# EAGLE schematic UCirKitBreadboardWithEverythingBottom-08201626 (EAGLE 6.5.0), part 1 of 2
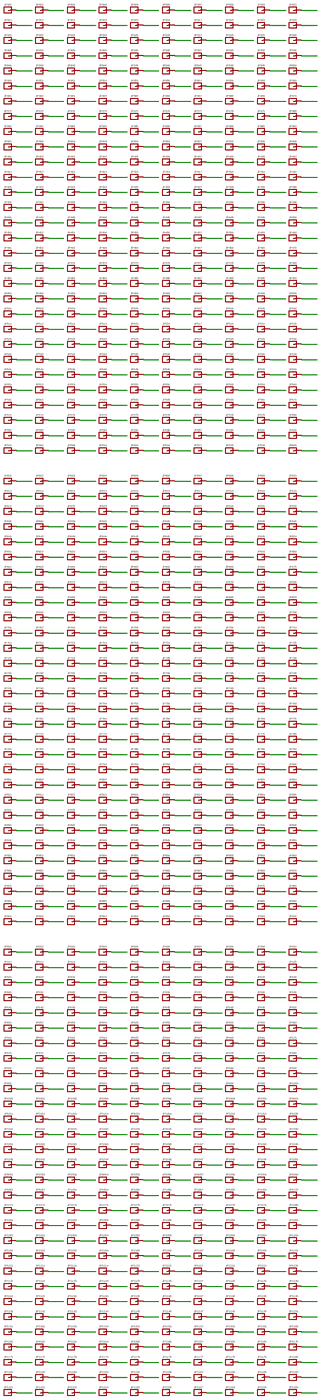
[diagram p0: schematic, sheet 1, overview]
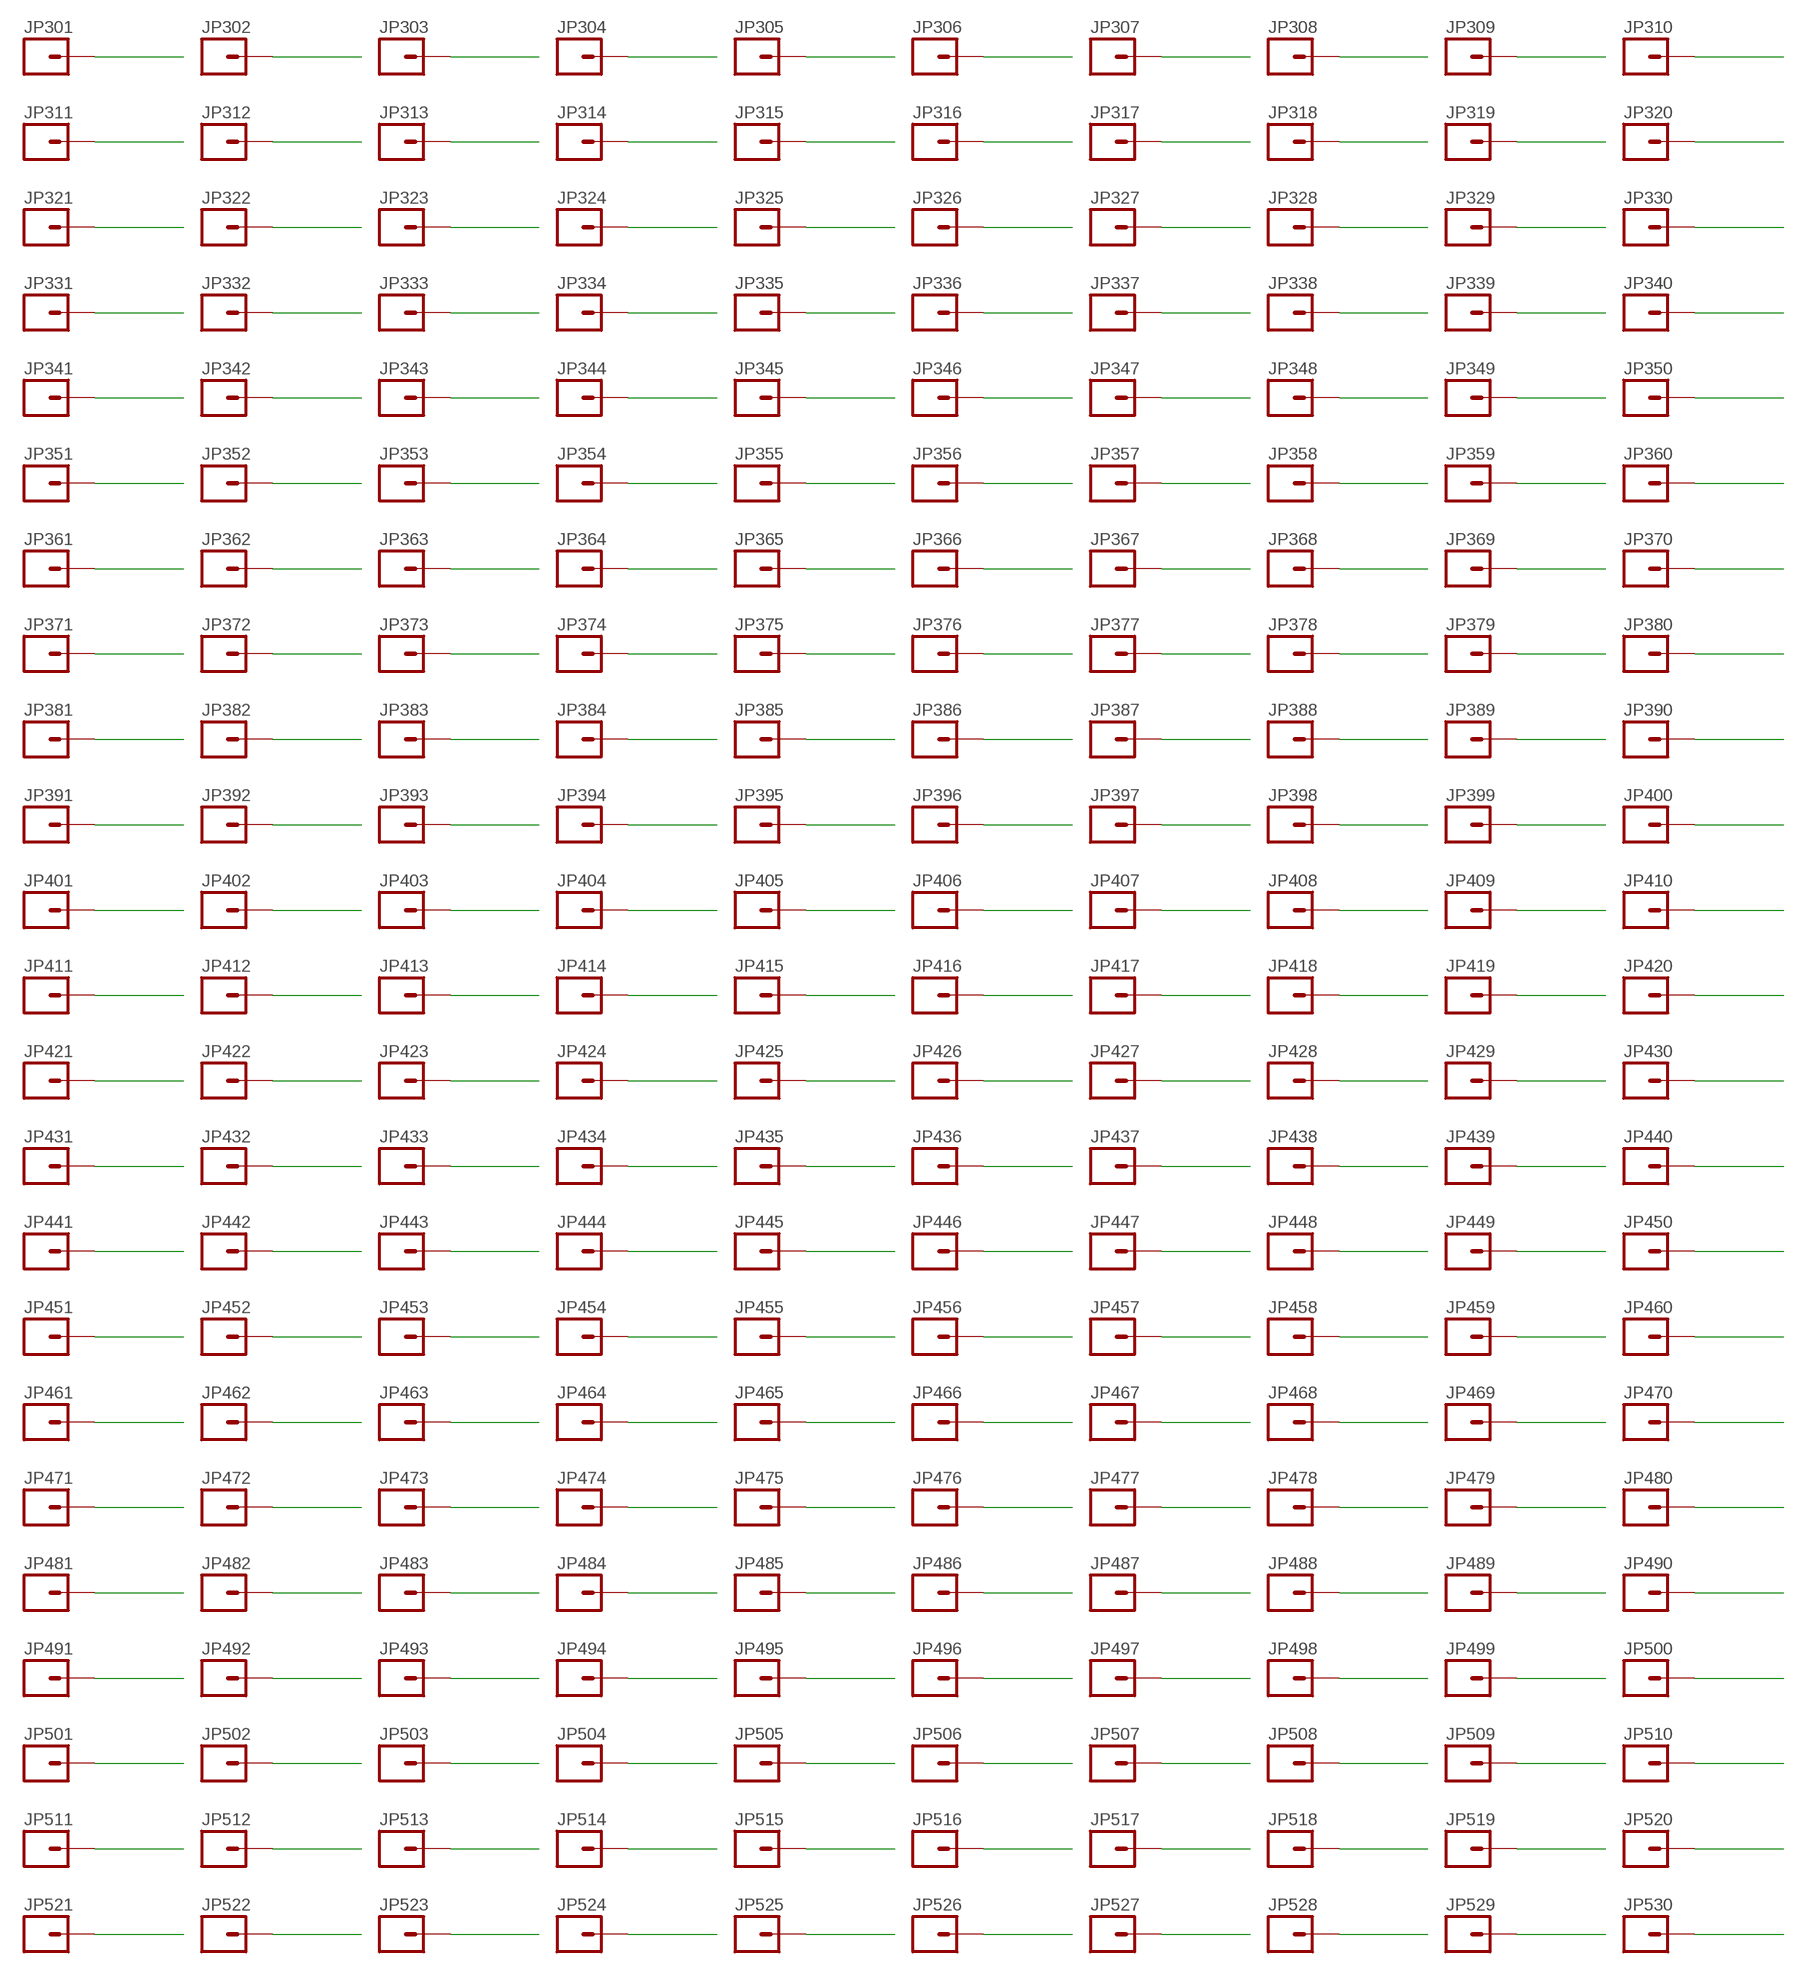
[diagram p1: schematic, sheet 1, part 1 of 4]
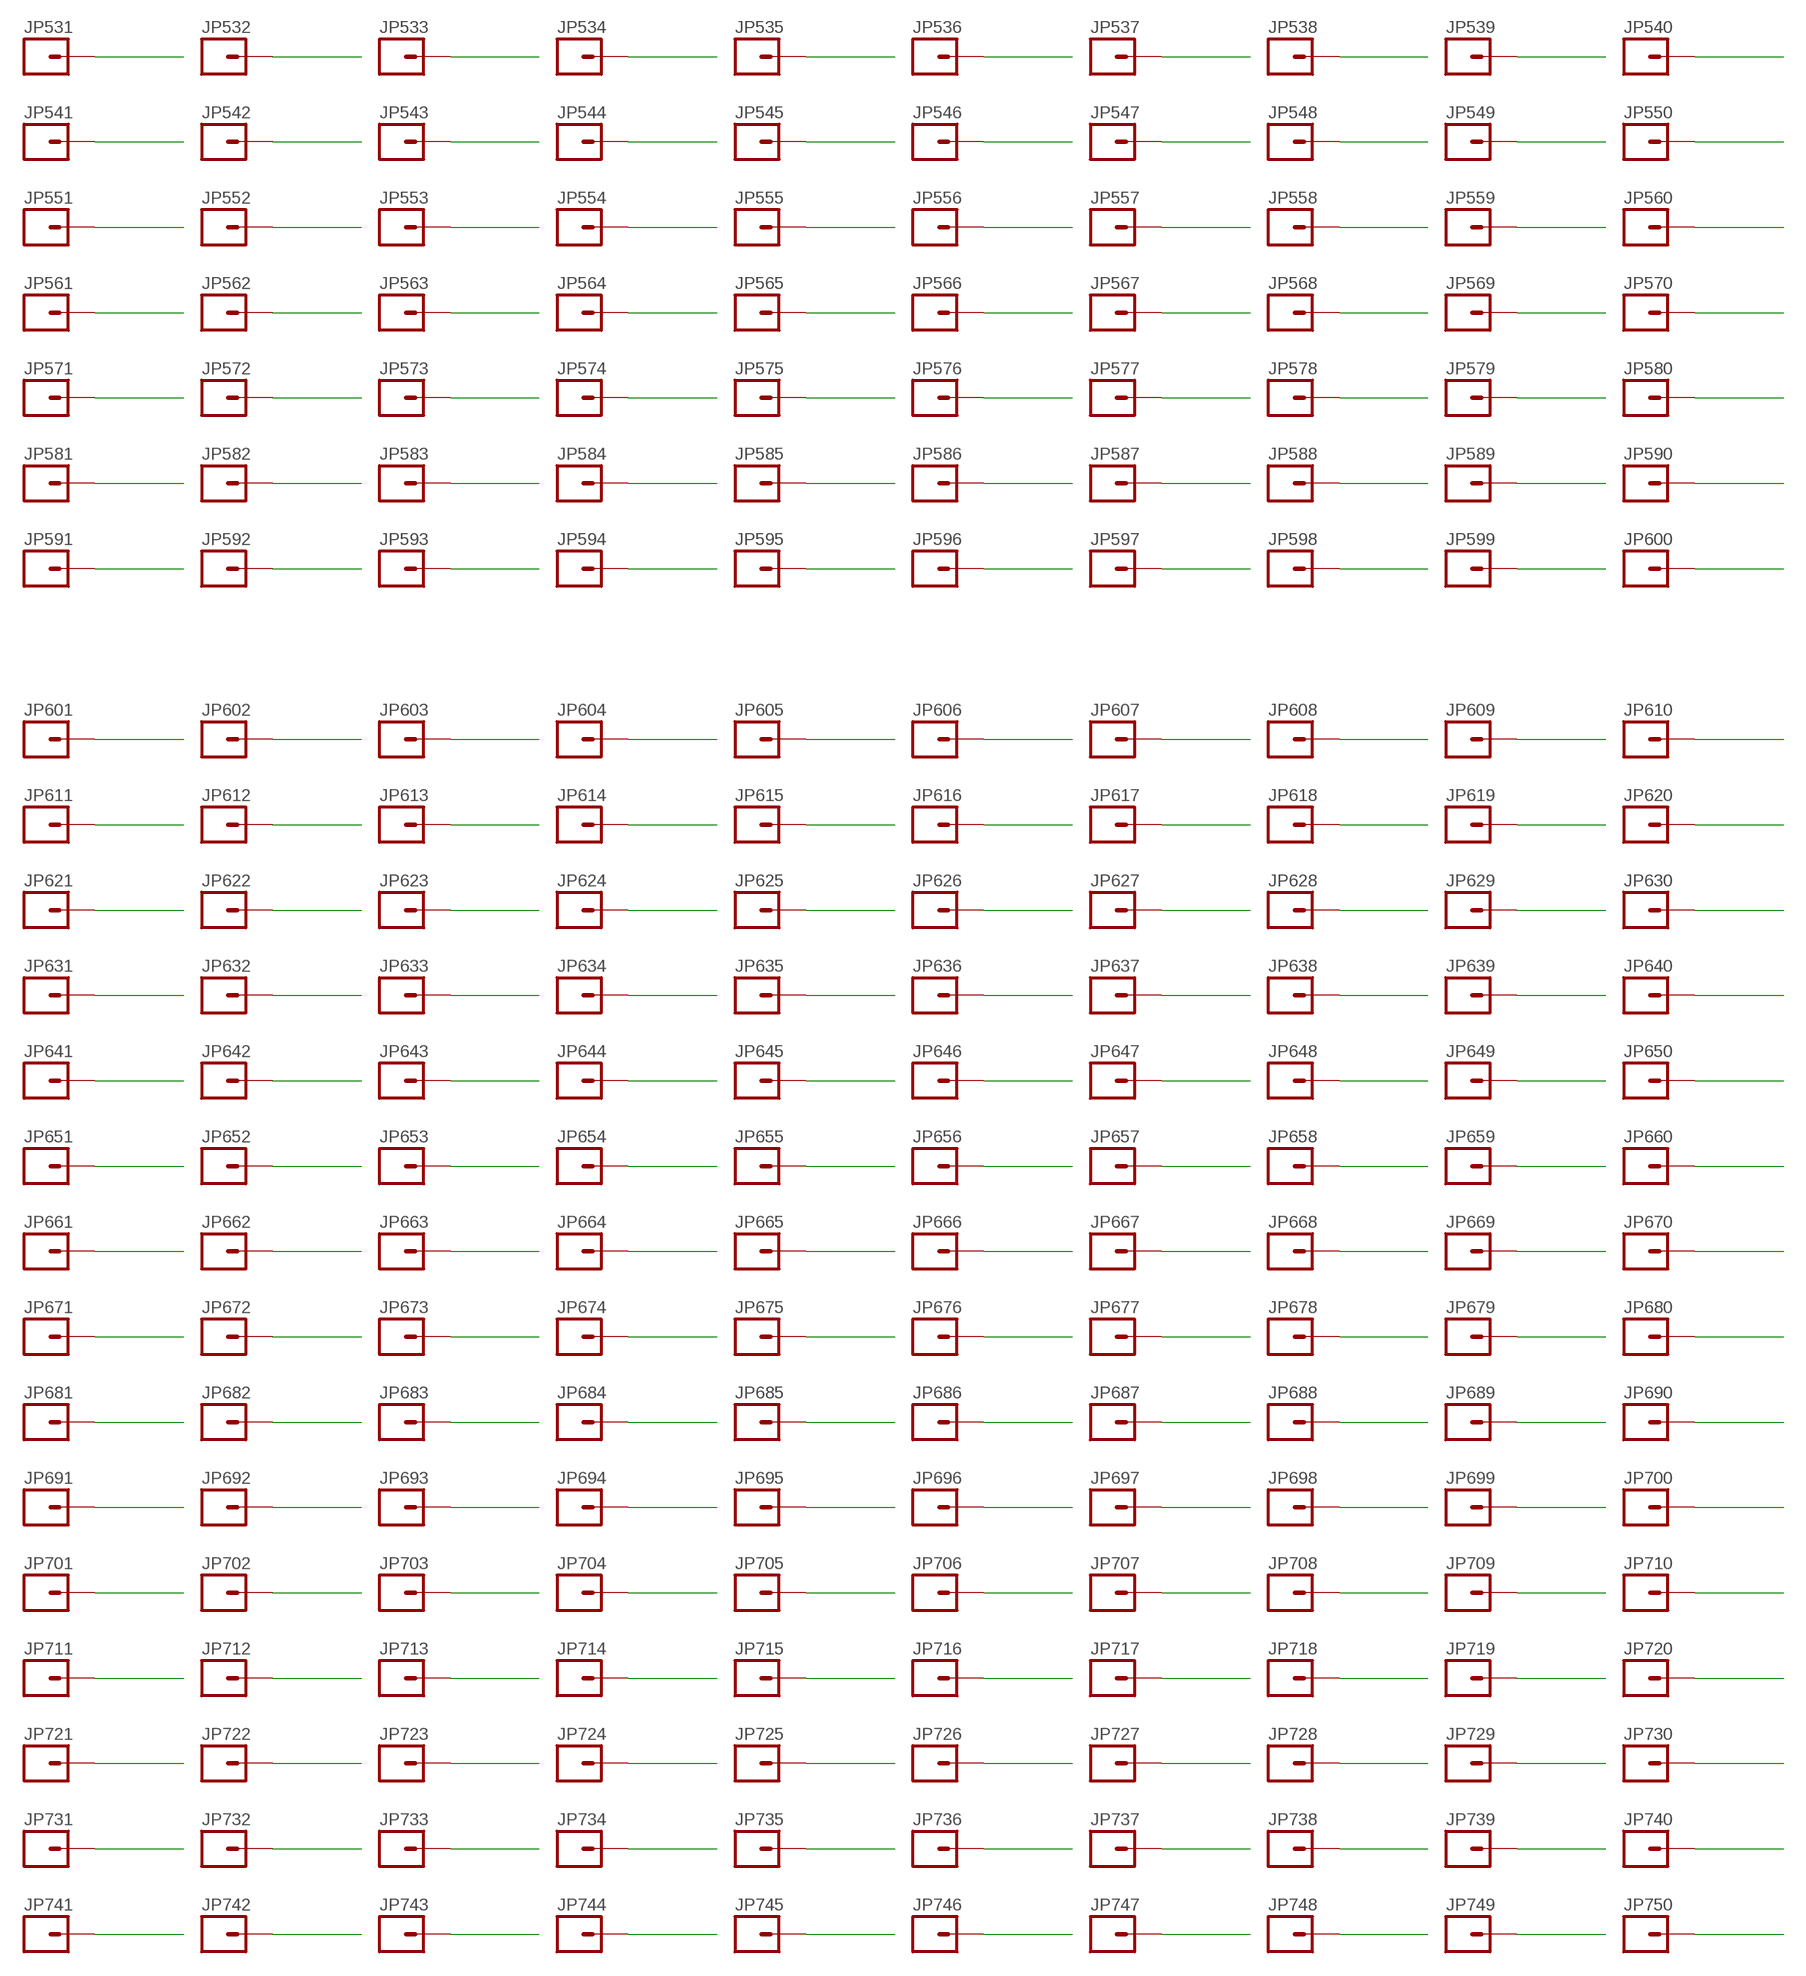
[diagram p2: schematic, sheet 1, part 2 of 4]
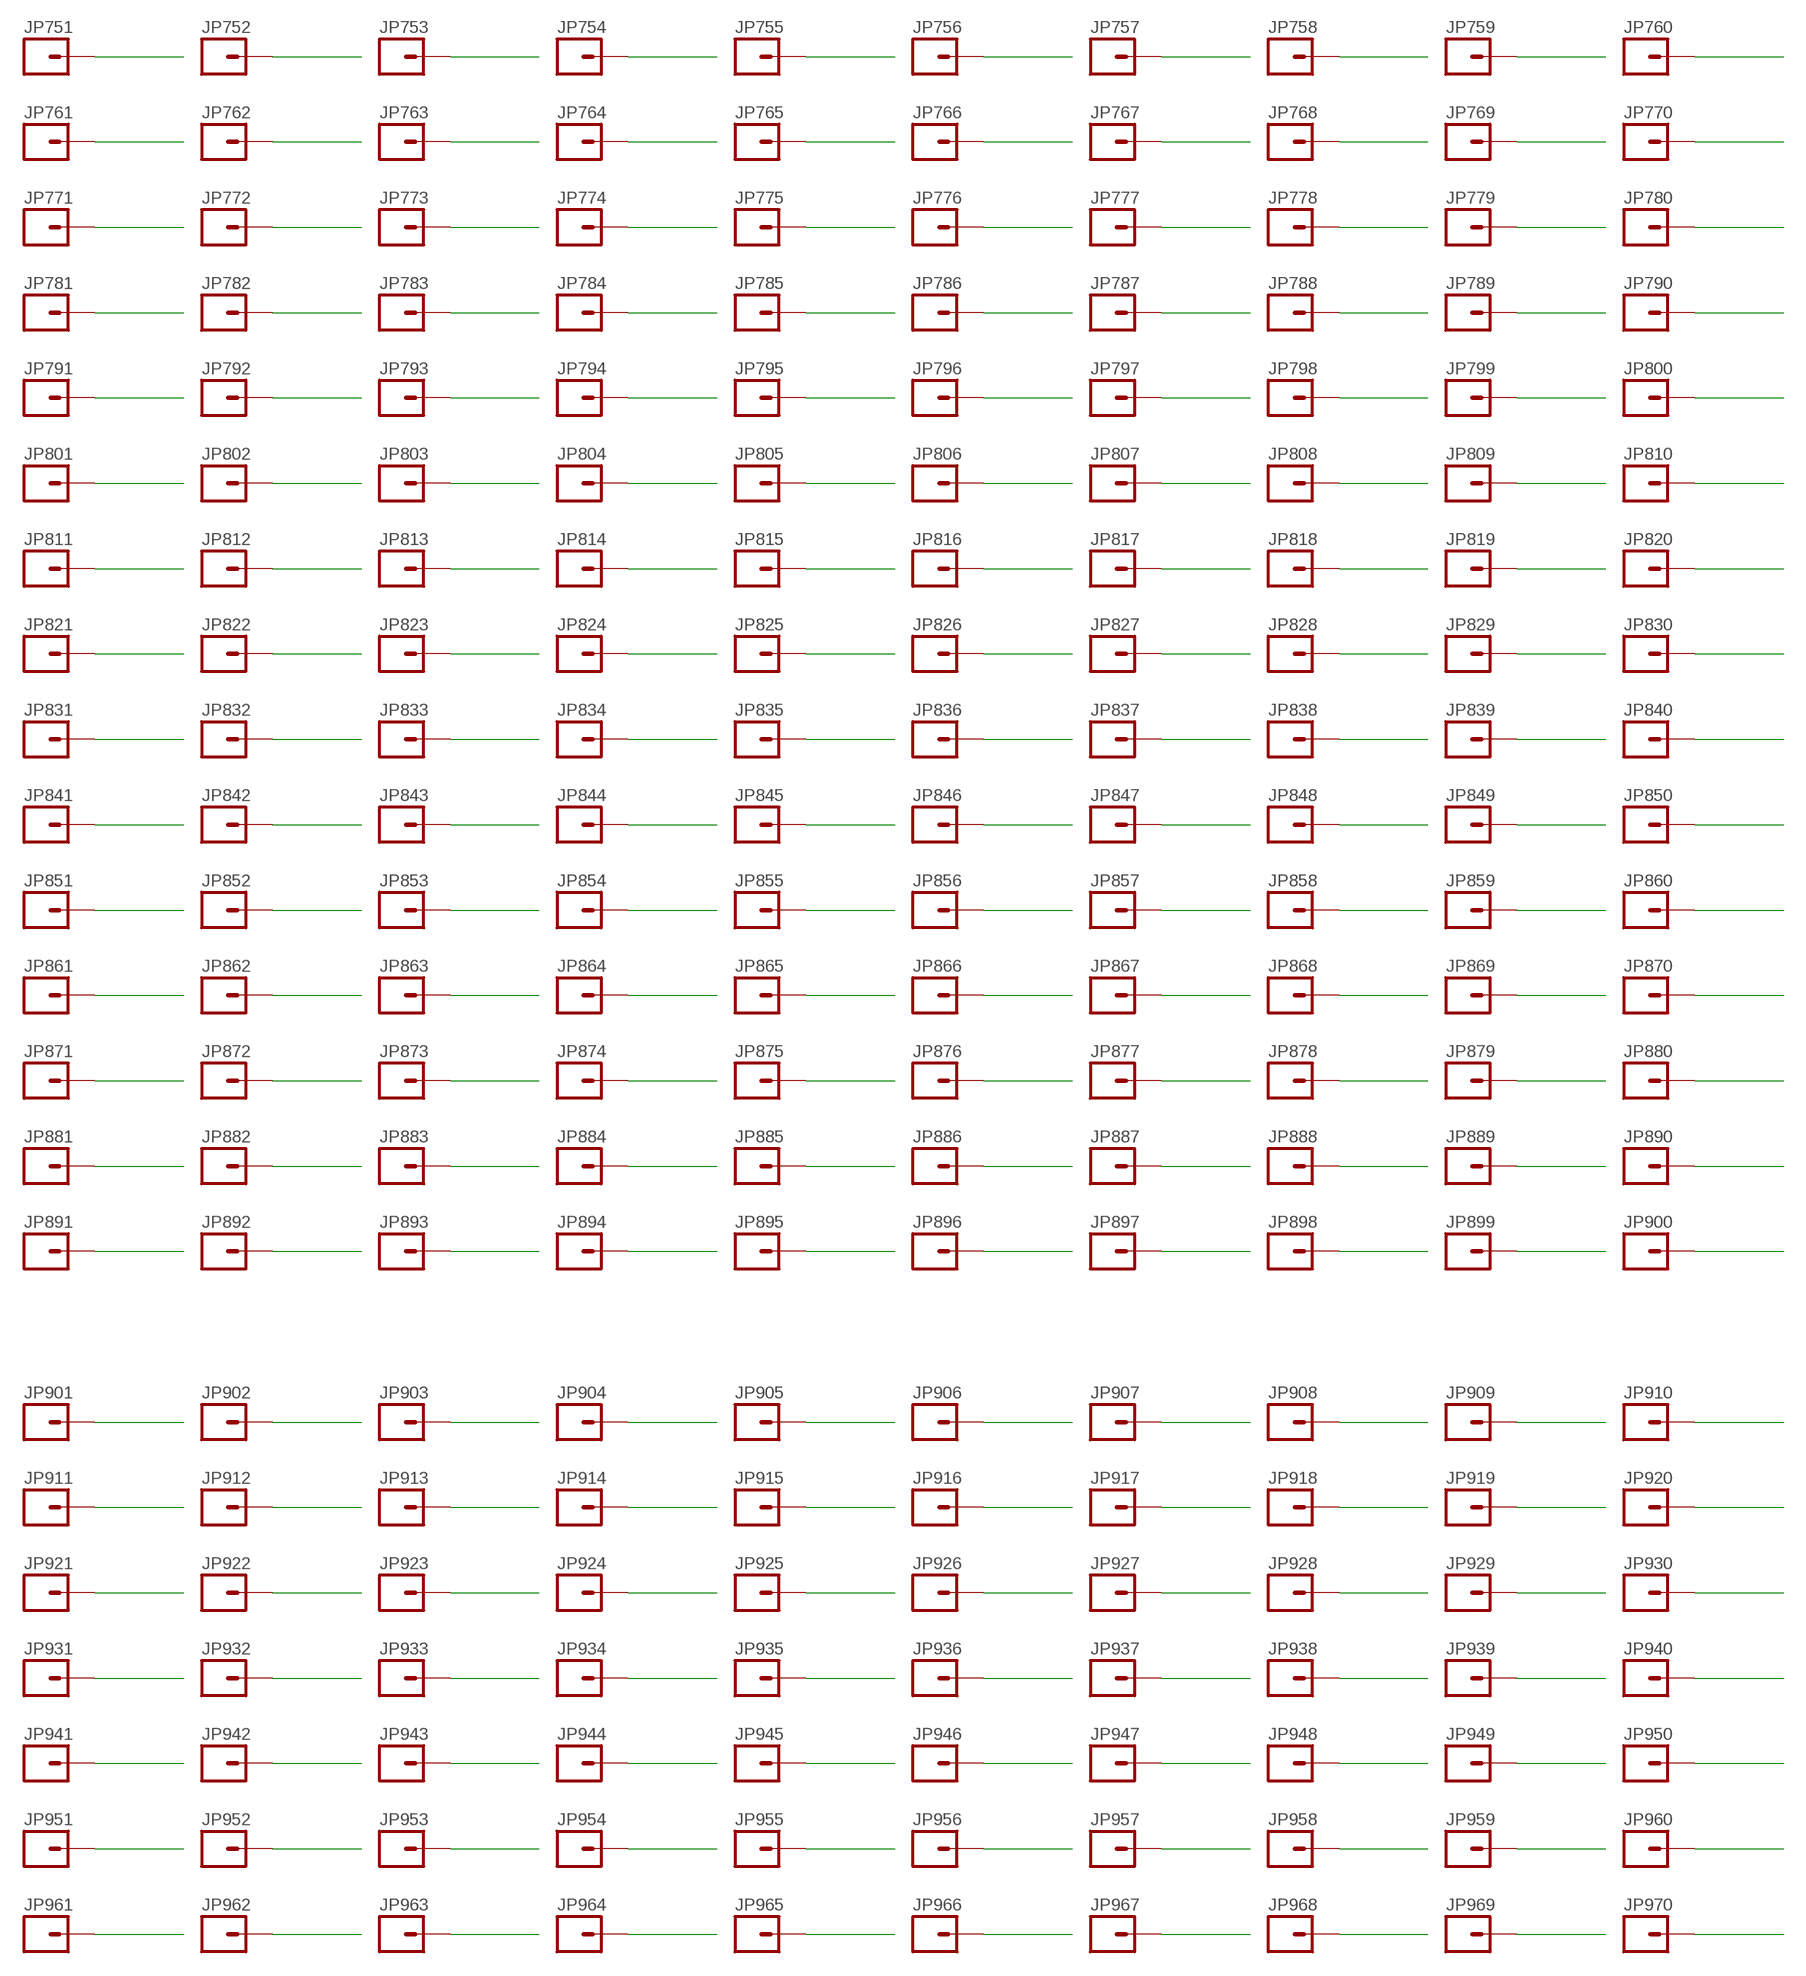
[diagram p3: schematic, sheet 1, part 3 of 4]
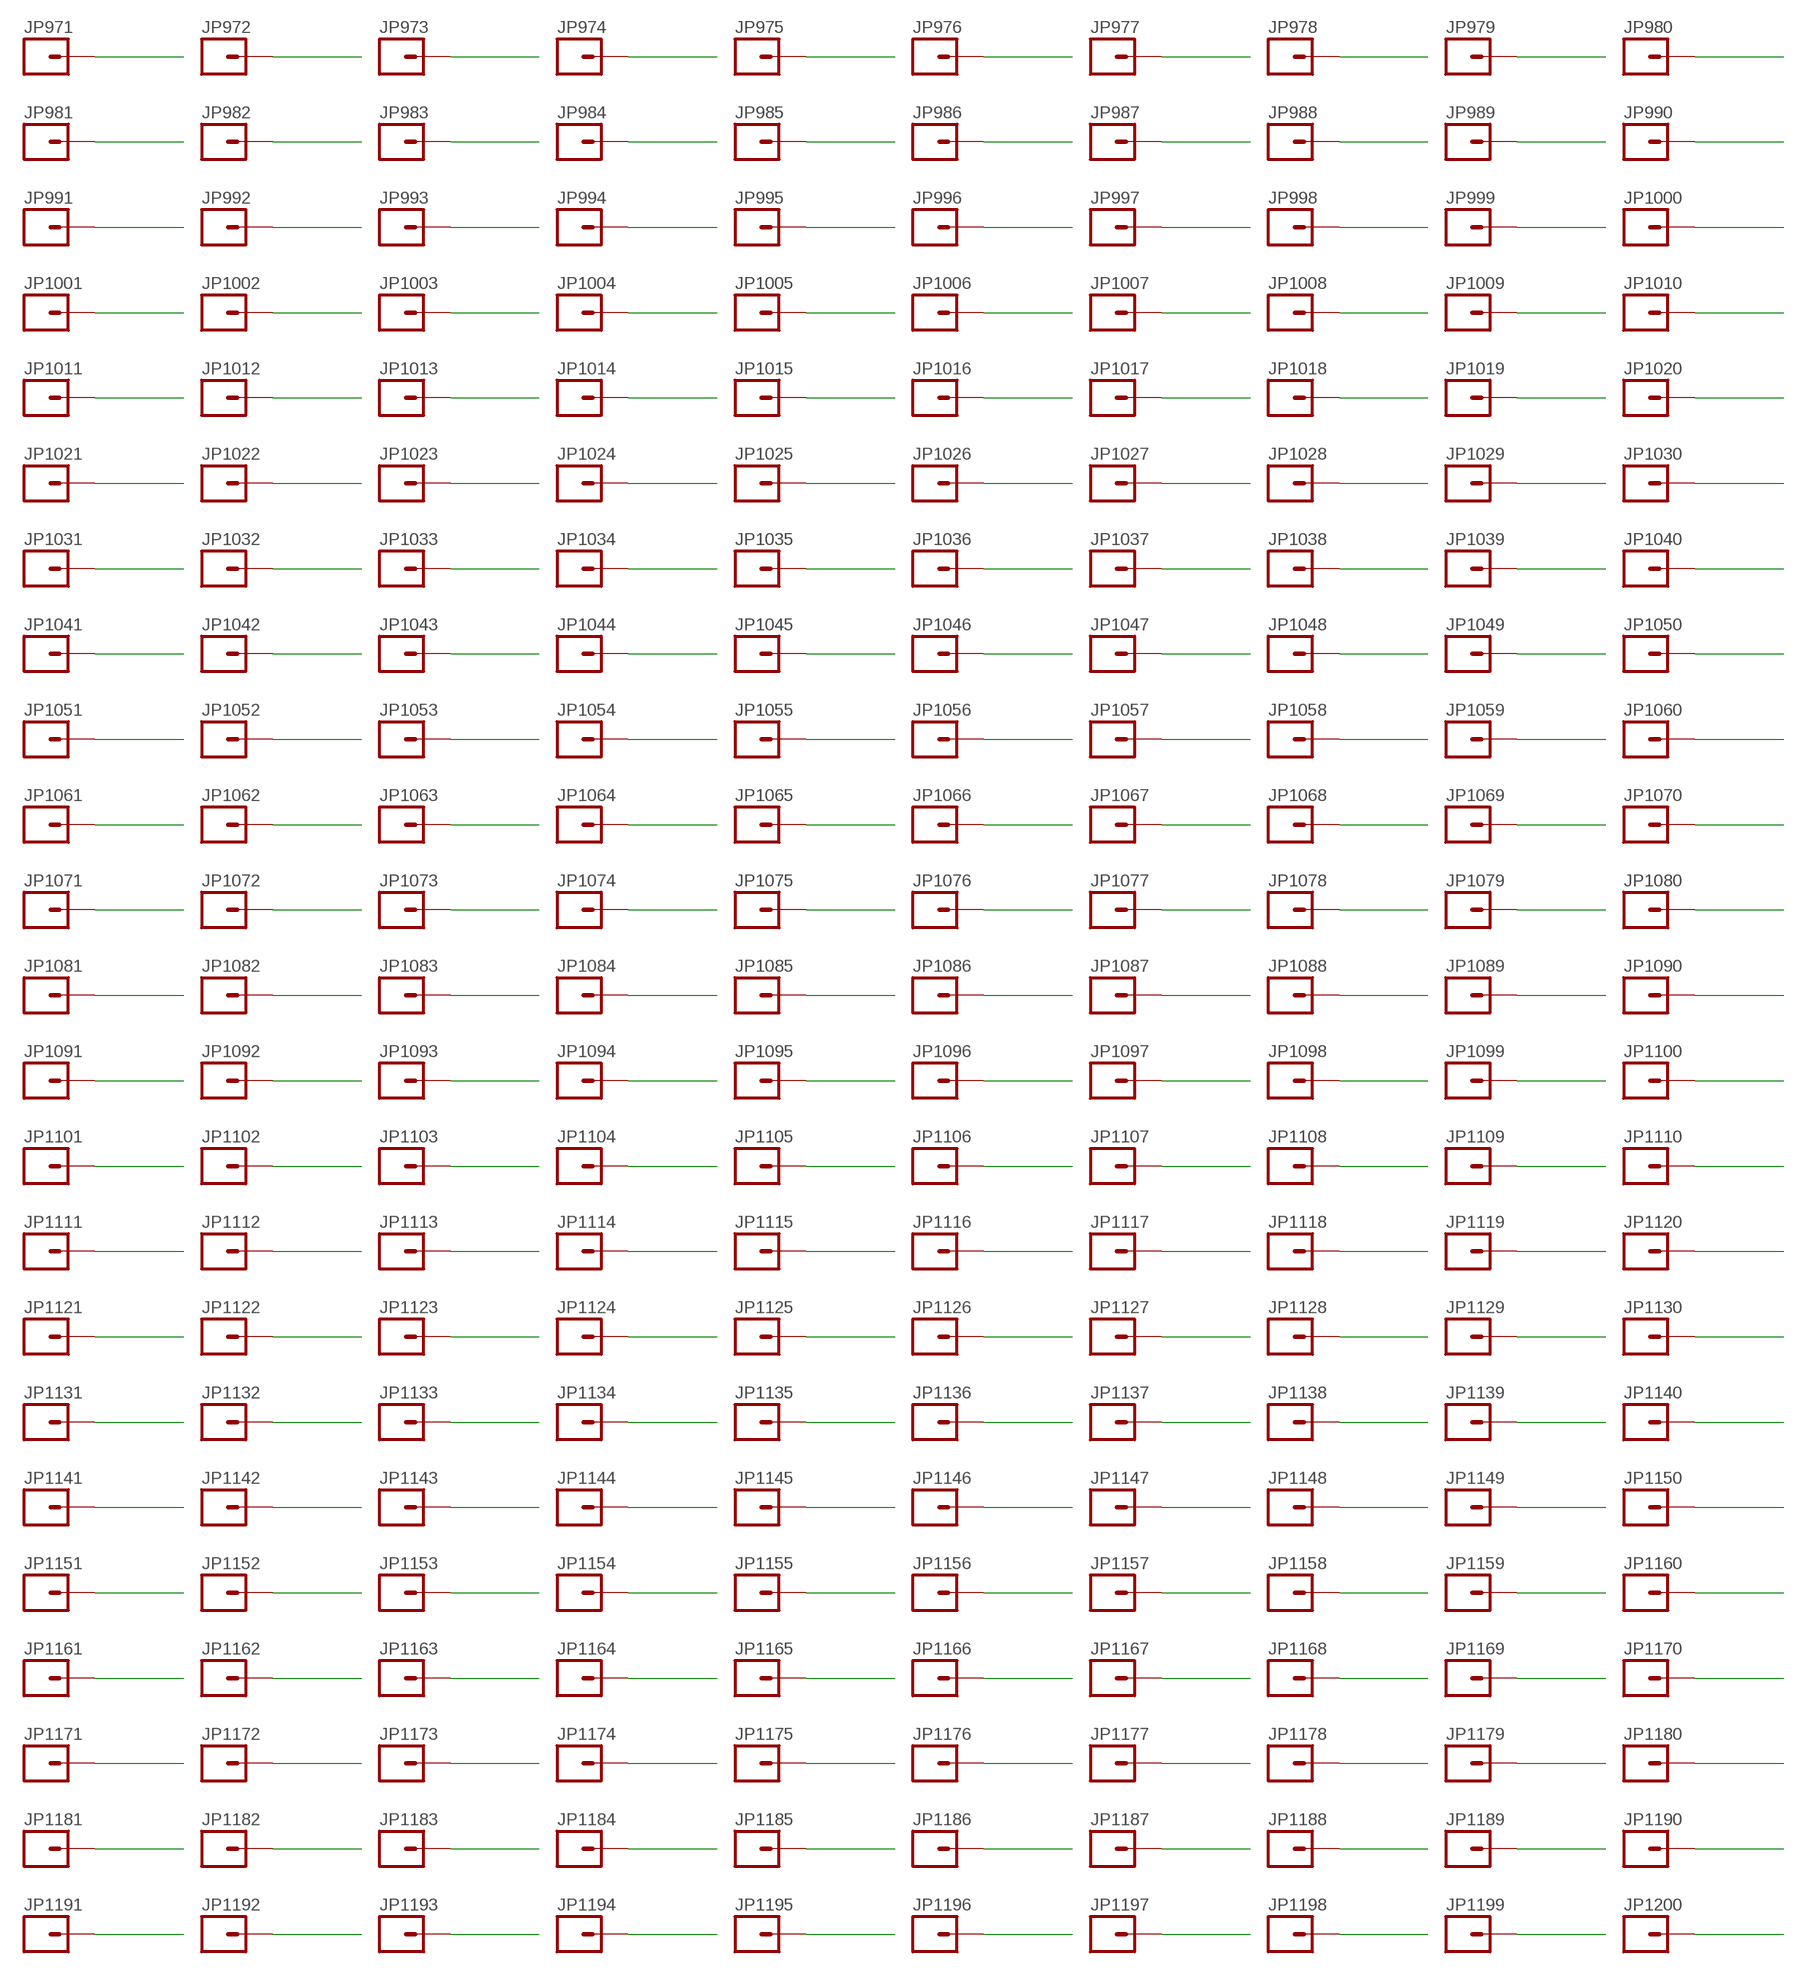
[diagram p4: schematic, sheet 1, part 4 of 4]

## Parts
JP301  M01PTH_SMD_3.25X0.85MM_NO_SILK  [1X01_SMD_3.25X0.85MM_NO_SILK]
JP302  M01PTH_SMD_3.25X0.85MM_NO_SILK  [1X01_SMD_3.25X0.85MM_NO_SILK]
JP303  M01PTH_SMD_3.25X0.85MM_NO_SILK  [1X01_SMD_3.25X0.85MM_NO_SILK]
JP304  M01PTH_SMD_3.25X0.85MM_NO_SILK  [1X01_SMD_3.25X0.85MM_NO_SILK]
JP305  M01PTH_SMD_3.25X0.85MM_NO_SILK  [1X01_SMD_3.25X0.85MM_NO_SILK]
JP306  M01PTH_SMD_3.25X0.85MM_NO_SILK  [1X01_SMD_3.25X0.85MM_NO_SILK]
JP307  M01PTH_SMD_3.25X0.85MM_NO_SILK  [1X01_SMD_3.25X0.85MM_NO_SILK]
JP308  M01PTH_SMD_3.25X0.85MM_NO_SILK  [1X01_SMD_3.25X0.85MM_NO_SILK]
JP309  M01PTH_SMD_3.25X0.85MM_NO_SILK  [1X01_SMD_3.25X0.85MM_NO_SILK]
JP310  M01PTH_SMD_3.25X0.85MM_NO_SILK  [1X01_SMD_3.25X0.85MM_NO_SILK]
JP311  M01PTH_SMD_3.25X0.85MM_NO_SILK  [1X01_SMD_3.25X0.85MM_NO_SILK]
JP312  M01PTH_SMD_3.25X0.85MM_NO_SILK  [1X01_SMD_3.25X0.85MM_NO_SILK]
JP313  M01PTH_SMD_3.25X0.85MM_NO_SILK  [1X01_SMD_3.25X0.85MM_NO_SILK]
JP314  M01PTH_SMD_3.25X0.85MM_NO_SILK  [1X01_SMD_3.25X0.85MM_NO_SILK]
JP315  M01PTH_SMD_3.25X0.85MM_NO_SILK  [1X01_SMD_3.25X0.85MM_NO_SILK]
JP316  M01PTH_SMD_3.25X0.85MM_NO_SILK  [1X01_SMD_3.25X0.85MM_NO_SILK]
JP317  M01PTH_SMD_3.25X0.85MM_NO_SILK  [1X01_SMD_3.25X0.85MM_NO_SILK]
JP318  M01PTH_SMD_3.25X0.85MM_NO_SILK  [1X01_SMD_3.25X0.85MM_NO_SILK]
JP319  M01PTH_SMD_3.25X0.85MM_NO_SILK  [1X01_SMD_3.25X0.85MM_NO_SILK]
JP320  M01PTH_SMD_3.25X0.85MM_NO_SILK  [1X01_SMD_3.25X0.85MM_NO_SILK]
JP321  M01PTH_SMD_3.25X0.85MM_NO_SILK  [1X01_SMD_3.25X0.85MM_NO_SILK]
JP322  M01PTH_SMD_3.25X0.85MM_NO_SILK  [1X01_SMD_3.25X0.85MM_NO_SILK]
JP323  M01PTH_SMD_3.25X0.85MM_NO_SILK  [1X01_SMD_3.25X0.85MM_NO_SILK]
JP324  M01PTH_SMD_3.25X0.85MM_NO_SILK  [1X01_SMD_3.25X0.85MM_NO_SILK]
JP325  M01PTH_SMD_3.25X0.85MM_NO_SILK  [1X01_SMD_3.25X0.85MM_NO_SILK]
JP326  M01PTH_SMD_3.25X0.85MM_NO_SILK  [1X01_SMD_3.25X0.85MM_NO_SILK]
JP327  M01PTH_SMD_3.25X0.85MM_NO_SILK  [1X01_SMD_3.25X0.85MM_NO_SILK]
JP328  M01PTH_SMD_3.25X0.85MM_NO_SILK  [1X01_SMD_3.25X0.85MM_NO_SILK]
JP329  M01PTH_SMD_3.25X0.85MM_NO_SILK  [1X01_SMD_3.25X0.85MM_NO_SILK]
JP330  M01PTH_SMD_3.25X0.85MM_NO_SILK  [1X01_SMD_3.25X0.85MM_NO_SILK]
JP331  M01PTH_SMD_3.25X0.85MM_NO_SILK  [1X01_SMD_3.25X0.85MM_NO_SILK]
JP332  M01PTH_SMD_3.25X0.85MM_NO_SILK  [1X01_SMD_3.25X0.85MM_NO_SILK]
JP333  M01PTH_SMD_3.25X0.85MM_NO_SILK  [1X01_SMD_3.25X0.85MM_NO_SILK]
JP334  M01PTH_SMD_3.25X0.85MM_NO_SILK  [1X01_SMD_3.25X0.85MM_NO_SILK]
JP335  M01PTH_SMD_3.25X0.85MM_NO_SILK  [1X01_SMD_3.25X0.85MM_NO_SILK]
JP336  M01PTH_SMD_3.25X0.85MM_NO_SILK  [1X01_SMD_3.25X0.85MM_NO_SILK]
JP337  M01PTH_SMD_3.25X0.85MM_NO_SILK  [1X01_SMD_3.25X0.85MM_NO_SILK]
JP338  M01PTH_SMD_3.25X0.85MM_NO_SILK  [1X01_SMD_3.25X0.85MM_NO_SILK]
JP339  M01PTH_SMD_3.25X0.85MM_NO_SILK  [1X01_SMD_3.25X0.85MM_NO_SILK]
JP340  M01PTH_SMD_3.25X0.85MM_NO_SILK  [1X01_SMD_3.25X0.85MM_NO_SILK]
JP341  M01PTH_SMD_3.25X0.85MM_NO_SILK  [1X01_SMD_3.25X0.85MM_NO_SILK]
JP342  M01PTH_SMD_3.25X0.85MM_NO_SILK  [1X01_SMD_3.25X0.85MM_NO_SILK]
JP343  M01PTH_SMD_3.25X0.85MM_NO_SILK  [1X01_SMD_3.25X0.85MM_NO_SILK]
JP344  M01PTH_SMD_3.25X0.85MM_NO_SILK  [1X01_SMD_3.25X0.85MM_NO_SILK]
JP345  M01PTH_SMD_3.25X0.85MM_NO_SILK  [1X01_SMD_3.25X0.85MM_NO_SILK]
JP346  M01PTH_SMD_3.25X0.85MM_NO_SILK  [1X01_SMD_3.25X0.85MM_NO_SILK]
JP347  M01PTH_SMD_3.25X0.85MM_NO_SILK  [1X01_SMD_3.25X0.85MM_NO_SILK]
JP348  M01PTH_SMD_3.25X0.85MM_NO_SILK  [1X01_SMD_3.25X0.85MM_NO_SILK]
JP349  M01PTH_SMD_3.25X0.85MM_NO_SILK  [1X01_SMD_3.25X0.85MM_NO_SILK]
JP350  M01PTH_SMD_3.25X0.85MM_NO_SILK  [1X01_SMD_3.25X0.85MM_NO_SILK]
JP351  M01PTH_SMD_3.25X0.85MM_NO_SILK  [1X01_SMD_3.25X0.85MM_NO_SILK]
JP352  M01PTH_SMD_3.25X0.85MM_NO_SILK  [1X01_SMD_3.25X0.85MM_NO_SILK]
JP353  M01PTH_SMD_3.25X0.85MM_NO_SILK  [1X01_SMD_3.25X0.85MM_NO_SILK]
JP354  M01PTH_SMD_3.25X0.85MM_NO_SILK  [1X01_SMD_3.25X0.85MM_NO_SILK]
JP355  M01PTH_SMD_3.25X0.85MM_NO_SILK  [1X01_SMD_3.25X0.85MM_NO_SILK]
JP356  M01PTH_SMD_3.25X0.85MM_NO_SILK  [1X01_SMD_3.25X0.85MM_NO_SILK]
JP357  M01PTH_SMD_3.25X0.85MM_NO_SILK  [1X01_SMD_3.25X0.85MM_NO_SILK]
JP358  M01PTH_SMD_3.25X0.85MM_NO_SILK  [1X01_SMD_3.25X0.85MM_NO_SILK]
JP359  M01PTH_SMD_3.25X0.85MM_NO_SILK  [1X01_SMD_3.25X0.85MM_NO_SILK]
JP360  M01PTH_SMD_3.25X0.85MM_NO_SILK  [1X01_SMD_3.25X0.85MM_NO_SILK]
JP361  M01PTH_SMD_3.25X0.85MM_NO_SILK  [1X01_SMD_3.25X0.85MM_NO_SILK]
JP362  M01PTH_SMD_3.25X0.85MM_NO_SILK  [1X01_SMD_3.25X0.85MM_NO_SILK]
JP363  M01PTH_SMD_3.25X0.85MM_NO_SILK  [1X01_SMD_3.25X0.85MM_NO_SILK]
JP364  M01PTH_SMD_3.25X0.85MM_NO_SILK  [1X01_SMD_3.25X0.85MM_NO_SILK]
JP365  M01PTH_SMD_3.25X0.85MM_NO_SILK  [1X01_SMD_3.25X0.85MM_NO_SILK]
JP366  M01PTH_SMD_3.25X0.85MM_NO_SILK  [1X01_SMD_3.25X0.85MM_NO_SILK]
JP367  M01PTH_SMD_3.25X0.85MM_NO_SILK  [1X01_SMD_3.25X0.85MM_NO_SILK]
JP368  M01PTH_SMD_3.25X0.85MM_NO_SILK  [1X01_SMD_3.25X0.85MM_NO_SILK]
JP369  M01PTH_SMD_3.25X0.85MM_NO_SILK  [1X01_SMD_3.25X0.85MM_NO_SILK]
JP370  M01PTH_SMD_3.25X0.85MM_NO_SILK  [1X01_SMD_3.25X0.85MM_NO_SILK]
JP371  M01PTH_SMD_3.25X0.85MM_NO_SILK  [1X01_SMD_3.25X0.85MM_NO_SILK]
JP372  M01PTH_SMD_3.25X0.85MM_NO_SILK  [1X01_SMD_3.25X0.85MM_NO_SILK]
JP373  M01PTH_SMD_3.25X0.85MM_NO_SILK  [1X01_SMD_3.25X0.85MM_NO_SILK]
JP374  M01PTH_SMD_3.25X0.85MM_NO_SILK  [1X01_SMD_3.25X0.85MM_NO_SILK]
JP375  M01PTH_SMD_3.25X0.85MM_NO_SILK  [1X01_SMD_3.25X0.85MM_NO_SILK]
JP376  M01PTH_SMD_3.25X0.85MM_NO_SILK  [1X01_SMD_3.25X0.85MM_NO_SILK]
JP377  M01PTH_SMD_3.25X0.85MM_NO_SILK  [1X01_SMD_3.25X0.85MM_NO_SILK]
JP378  M01PTH_SMD_3.25X0.85MM_NO_SILK  [1X01_SMD_3.25X0.85MM_NO_SILK]
JP379  M01PTH_SMD_3.25X0.85MM_NO_SILK  [1X01_SMD_3.25X0.85MM_NO_SILK]
JP380  M01PTH_SMD_3.25X0.85MM_NO_SILK  [1X01_SMD_3.25X0.85MM_NO_SILK]
JP381  M01PTH_SMD_3.25X0.85MM_NO_SILK  [1X01_SMD_3.25X0.85MM_NO_SILK]
JP382  M01PTH_SMD_3.25X0.85MM_NO_SILK  [1X01_SMD_3.25X0.85MM_NO_SILK]
JP383  M01PTH_SMD_3.25X0.85MM_NO_SILK  [1X01_SMD_3.25X0.85MM_NO_SILK]
JP384  M01PTH_SMD_3.25X0.85MM_NO_SILK  [1X01_SMD_3.25X0.85MM_NO_SILK]
JP385  M01PTH_SMD_3.25X0.85MM_NO_SILK  [1X01_SMD_3.25X0.85MM_NO_SILK]
JP386  M01PTH_SMD_3.25X0.85MM_NO_SILK  [1X01_SMD_3.25X0.85MM_NO_SILK]
JP387  M01PTH_SMD_3.25X0.85MM_NO_SILK  [1X01_SMD_3.25X0.85MM_NO_SILK]
JP388  M01PTH_SMD_3.25X0.85MM_NO_SILK  [1X01_SMD_3.25X0.85MM_NO_SILK]
JP389  M01PTH_SMD_3.25X0.85MM_NO_SILK  [1X01_SMD_3.25X0.85MM_NO_SILK]
JP390  M01PTH_SMD_3.25X0.85MM_NO_SILK  [1X01_SMD_3.25X0.85MM_NO_SILK]
JP391  M01PTH_SMD_3.25X0.85MM_NO_SILK  [1X01_SMD_3.25X0.85MM_NO_SILK]
JP392  M01PTH_SMD_3.25X0.85MM_NO_SILK  [1X01_SMD_3.25X0.85MM_NO_SILK]
JP393  M01PTH_SMD_3.25X0.85MM_NO_SILK  [1X01_SMD_3.25X0.85MM_NO_SILK]
JP394  M01PTH_SMD_3.25X0.85MM_NO_SILK  [1X01_SMD_3.25X0.85MM_NO_SILK]
JP395  M01PTH_SMD_3.25X0.85MM_NO_SILK  [1X01_SMD_3.25X0.85MM_NO_SILK]
JP396  M01PTH_SMD_3.25X0.85MM_NO_SILK  [1X01_SMD_3.25X0.85MM_NO_SILK]
JP397  M01PTH_SMD_3.25X0.85MM_NO_SILK  [1X01_SMD_3.25X0.85MM_NO_SILK]
JP398  M01PTH_SMD_3.25X0.85MM_NO_SILK  [1X01_SMD_3.25X0.85MM_NO_SILK]
JP399  M01PTH_SMD_3.25X0.85MM_NO_SILK  [1X01_SMD_3.25X0.85MM_NO_SILK]
JP400  M01PTH_SMD_3.25X0.85MM_NO_SILK  [1X01_SMD_3.25X0.85MM_NO_SILK]
JP401  M01PTH_SMD_3.25X0.85MM_NO_SILK  [1X01_SMD_3.25X0.85MM_NO_SILK]
JP402  M01PTH_SMD_3.25X0.85MM_NO_SILK  [1X01_SMD_3.25X0.85MM_NO_SILK]
JP403  M01PTH_SMD_3.25X0.85MM_NO_SILK  [1X01_SMD_3.25X0.85MM_NO_SILK]
JP404  M01PTH_SMD_3.25X0.85MM_NO_SILK  [1X01_SMD_3.25X0.85MM_NO_SILK]
JP405  M01PTH_SMD_3.25X0.85MM_NO_SILK  [1X01_SMD_3.25X0.85MM_NO_SILK]
JP406  M01PTH_SMD_3.25X0.85MM_NO_SILK  [1X01_SMD_3.25X0.85MM_NO_SILK]
JP407  M01PTH_SMD_3.25X0.85MM_NO_SILK  [1X01_SMD_3.25X0.85MM_NO_SILK]
JP408  M01PTH_SMD_3.25X0.85MM_NO_SILK  [1X01_SMD_3.25X0.85MM_NO_SILK]
JP409  M01PTH_SMD_3.25X0.85MM_NO_SILK  [1X01_SMD_3.25X0.85MM_NO_SILK]
JP410  M01PTH_SMD_3.25X0.85MM_NO_SILK  [1X01_SMD_3.25X0.85MM_NO_SILK]
JP411  M01PTH_SMD_3.25X0.85MM_NO_SILK  [1X01_SMD_3.25X0.85MM_NO_SILK]
JP412  M01PTH_SMD_3.25X0.85MM_NO_SILK  [1X01_SMD_3.25X0.85MM_NO_SILK]
JP413  M01PTH_SMD_3.25X0.85MM_NO_SILK  [1X01_SMD_3.25X0.85MM_NO_SILK]
JP414  M01PTH_SMD_3.25X0.85MM_NO_SILK  [1X01_SMD_3.25X0.85MM_NO_SILK]
JP415  M01PTH_SMD_3.25X0.85MM_NO_SILK  [1X01_SMD_3.25X0.85MM_NO_SILK]
JP416  M01PTH_SMD_3.25X0.85MM_NO_SILK  [1X01_SMD_3.25X0.85MM_NO_SILK]
JP417  M01PTH_SMD_3.25X0.85MM_NO_SILK  [1X01_SMD_3.25X0.85MM_NO_SILK]
JP418  M01PTH_SMD_3.25X0.85MM_NO_SILK  [1X01_SMD_3.25X0.85MM_NO_SILK]
JP419  M01PTH_SMD_3.25X0.85MM_NO_SILK  [1X01_SMD_3.25X0.85MM_NO_SILK]
JP420  M01PTH_SMD_3.25X0.85MM_NO_SILK  [1X01_SMD_3.25X0.85MM_NO_SILK]
JP421  M01PTH_SMD_3.25X0.85MM_NO_SILK  [1X01_SMD_3.25X0.85MM_NO_SILK]
JP422  M01PTH_SMD_3.25X0.85MM_NO_SILK  [1X01_SMD_3.25X0.85MM_NO_SILK]
JP423  M01PTH_SMD_3.25X0.85MM_NO_SILK  [1X01_SMD_3.25X0.85MM_NO_SILK]
JP424  M01PTH_SMD_3.25X0.85MM_NO_SILK  [1X01_SMD_3.25X0.85MM_NO_SILK]
JP425  M01PTH_SMD_3.25X0.85MM_NO_SILK  [1X01_SMD_3.25X0.85MM_NO_SILK]
JP426  M01PTH_SMD_3.25X0.85MM_NO_SILK  [1X01_SMD_3.25X0.85MM_NO_SILK]
JP427  M01PTH_SMD_3.25X0.85MM_NO_SILK  [1X01_SMD_3.25X0.85MM_NO_SILK]
JP428  M01PTH_SMD_3.25X0.85MM_NO_SILK  [1X01_SMD_3.25X0.85MM_NO_SILK]
JP429  M01PTH_SMD_3.25X0.85MM_NO_SILK  [1X01_SMD_3.25X0.85MM_NO_SILK]
JP430  M01PTH_SMD_3.25X0.85MM_NO_SILK  [1X01_SMD_3.25X0.85MM_NO_SILK]
JP431  M01PTH_SMD_3.25X0.85MM_NO_SILK  [1X01_SMD_3.25X0.85MM_NO_SILK]
JP432  M01PTH_SMD_3.25X0.85MM_NO_SILK  [1X01_SMD_3.25X0.85MM_NO_SILK]
JP433  M01PTH_SMD_3.25X0.85MM_NO_SILK  [1X01_SMD_3.25X0.85MM_NO_SILK]
JP434  M01PTH_SMD_3.25X0.85MM_NO_SILK  [1X01_SMD_3.25X0.85MM_NO_SILK]
JP435  M01PTH_SMD_3.25X0.85MM_NO_SILK  [1X01_SMD_3.25X0.85MM_NO_SILK]
JP436  M01PTH_SMD_3.25X0.85MM_NO_SILK  [1X01_SMD_3.25X0.85MM_NO_SILK]
JP437  M01PTH_SMD_3.25X0.85MM_NO_SILK  [1X01_SMD_3.25X0.85MM_NO_SILK]
JP438  M01PTH_SMD_3.25X0.85MM_NO_SILK  [1X01_SMD_3.25X0.85MM_NO_SILK]
JP439  M01PTH_SMD_3.25X0.85MM_NO_SILK  [1X01_SMD_3.25X0.85MM_NO_SILK]
JP440  M01PTH_SMD_3.25X0.85MM_NO_SILK  [1X01_SMD_3.25X0.85MM_NO_SILK]
JP441  M01PTH_SMD_3.25X0.85MM_NO_SILK  [1X01_SMD_3.25X0.85MM_NO_SILK]
JP442  M01PTH_SMD_3.25X0.85MM_NO_SILK  [1X01_SMD_3.25X0.85MM_NO_SILK]
JP443  M01PTH_SMD_3.25X0.85MM_NO_SILK  [1X01_SMD_3.25X0.85MM_NO_SILK]
JP444  M01PTH_SMD_3.25X0.85MM_NO_SILK  [1X01_SMD_3.25X0.85MM_NO_SILK]
JP445  M01PTH_SMD_3.25X0.85MM_NO_SILK  [1X01_SMD_3.25X0.85MM_NO_SILK]
JP446  M01PTH_SMD_3.25X0.85MM_NO_SILK  [1X01_SMD_3.25X0.85MM_NO_SILK]
JP447  M01PTH_SMD_3.25X0.85MM_NO_SILK  [1X01_SMD_3.25X0.85MM_NO_SILK]
JP448  M01PTH_SMD_3.25X0.85MM_NO_SILK  [1X01_SMD_3.25X0.85MM_NO_SILK]
JP449  M01PTH_SMD_3.25X0.85MM_NO_SILK  [1X01_SMD_3.25X0.85MM_NO_SILK]
JP450  M01PTH_SMD_3.25X0.85MM_NO_SILK  [1X01_SMD_3.25X0.85MM_NO_SILK]
JP451  M01PTH_SMD_3.25X0.85MM_NO_SILK  [1X01_SMD_3.25X0.85MM_NO_SILK]
JP452  M01PTH_SMD_3.25X0.85MM_NO_SILK  [1X01_SMD_3.25X0.85MM_NO_SILK]
JP453  M01PTH_SMD_3.25X0.85MM_NO_SILK  [1X01_SMD_3.25X0.85MM_NO_SILK]
JP454  M01PTH_SMD_3.25X0.85MM_NO_SILK  [1X01_SMD_3.25X0.85MM_NO_SILK]
JP455  M01PTH_SMD_3.25X0.85MM_NO_SILK  [1X01_SMD_3.25X0.85MM_NO_SILK]
JP456  M01PTH_SMD_3.25X0.85MM_NO_SILK  [1X01_SMD_3.25X0.85MM_NO_SILK]
JP457  M01PTH_SMD_3.25X0.85MM_NO_SILK  [1X01_SMD_3.25X0.85MM_NO_SILK]
JP458  M01PTH_SMD_3.25X0.85MM_NO_SILK  [1X01_SMD_3.25X0.85MM_NO_SILK]
JP459  M01PTH_SMD_3.25X0.85MM_NO_SILK  [1X01_SMD_3.25X0.85MM_NO_SILK]
JP460  M01PTH_SMD_3.25X0.85MM_NO_SILK  [1X01_SMD_3.25X0.85MM_NO_SILK]
JP461  M01PTH_SMD_3.25X0.85MM_NO_SILK  [1X01_SMD_3.25X0.85MM_NO_SILK]
JP462  M01PTH_SMD_3.25X0.85MM_NO_SILK  [1X01_SMD_3.25X0.85MM_NO_SILK]
JP463  M01PTH_SMD_3.25X0.85MM_NO_SILK  [1X01_SMD_3.25X0.85MM_NO_SILK]
JP464  M01PTH_SMD_3.25X0.85MM_NO_SILK  [1X01_SMD_3.25X0.85MM_NO_SILK]
JP465  M01PTH_SMD_3.25X0.85MM_NO_SILK  [1X01_SMD_3.25X0.85MM_NO_SILK]
JP466  M01PTH_SMD_3.25X0.85MM_NO_SILK  [1X01_SMD_3.25X0.85MM_NO_SILK]
JP467  M01PTH_SMD_3.25X0.85MM_NO_SILK  [1X01_SMD_3.25X0.85MM_NO_SILK]
JP468  M01PTH_SMD_3.25X0.85MM_NO_SILK  [1X01_SMD_3.25X0.85MM_NO_SILK]
JP469  M01PTH_SMD_3.25X0.85MM_NO_SILK  [1X01_SMD_3.25X0.85MM_NO_SILK]
JP470  M01PTH_SMD_3.25X0.85MM_NO_SILK  [1X01_SMD_3.25X0.85MM_NO_SILK]
JP471  M01PTH_SMD_3.25X0.85MM_NO_SILK  [1X01_SMD_3.25X0.85MM_NO_SILK]
JP472  M01PTH_SMD_3.25X0.85MM_NO_SILK  [1X01_SMD_3.25X0.85MM_NO_SILK]
JP473  M01PTH_SMD_3.25X0.85MM_NO_SILK  [1X01_SMD_3.25X0.85MM_NO_SILK]
JP474  M01PTH_SMD_3.25X0.85MM_NO_SILK  [1X01_SMD_3.25X0.85MM_NO_SILK]
JP475  M01PTH_SMD_3.25X0.85MM_NO_SILK  [1X01_SMD_3.25X0.85MM_NO_SILK]
JP476  M01PTH_SMD_3.25X0.85MM_NO_SILK  [1X01_SMD_3.25X0.85MM_NO_SILK]
JP477  M01PTH_SMD_3.25X0.85MM_NO_SILK  [1X01_SMD_3.25X0.85MM_NO_SILK]
JP478  M01PTH_SMD_3.25X0.85MM_NO_SILK  [1X01_SMD_3.25X0.85MM_NO_SILK]
JP479  M01PTH_SMD_3.25X0.85MM_NO_SILK  [1X01_SMD_3.25X0.85MM_NO_SILK]
JP480  M01PTH_SMD_3.25X0.85MM_NO_SILK  [1X01_SMD_3.25X0.85MM_NO_SILK]
JP481  M01PTH_SMD_3.25X0.85MM_NO_SILK  [1X01_SMD_3.25X0.85MM_NO_SILK]
JP482  M01PTH_SMD_3.25X0.85MM_NO_SILK  [1X01_SMD_3.25X0.85MM_NO_SILK]
JP483  M01PTH_SMD_3.25X0.85MM_NO_SILK  [1X01_SMD_3.25X0.85MM_NO_SILK]
JP484  M01PTH_SMD_3.25X0.85MM_NO_SILK  [1X01_SMD_3.25X0.85MM_NO_SILK]
JP485  M01PTH_SMD_3.25X0.85MM_NO_SILK  [1X01_SMD_3.25X0.85MM_NO_SILK]
JP486  M01PTH_SMD_3.25X0.85MM_NO_SILK  [1X01_SMD_3.25X0.85MM_NO_SILK]
JP487  M01PTH_SMD_3.25X0.85MM_NO_SILK  [1X01_SMD_3.25X0.85MM_NO_SILK]
JP488  M01PTH_SMD_3.25X0.85MM_NO_SILK  [1X01_SMD_3.25X0.85MM_NO_SILK]
JP489  M01PTH_SMD_3.25X0.85MM_NO_SILK  [1X01_SMD_3.25X0.85MM_NO_SILK]
JP490  M01PTH_SMD_3.25X0.85MM_NO_SILK  [1X01_SMD_3.25X0.85MM_NO_SILK]
JP491  M01PTH_SMD_3.25X0.85MM_NO_SILK  [1X01_SMD_3.25X0.85MM_NO_SILK]
JP492  M01PTH_SMD_3.25X0.85MM_NO_SILK  [1X01_SMD_3.25X0.85MM_NO_SILK]
JP493  M01PTH_SMD_3.25X0.85MM_NO_SILK  [1X01_SMD_3.25X0.85MM_NO_SILK]
JP494  M01PTH_SMD_3.25X0.85MM_NO_SILK  [1X01_SMD_3.25X0.85MM_NO_SILK]
JP495  M01PTH_SMD_3.25X0.85MM_NO_SILK  [1X01_SMD_3.25X0.85MM_NO_SILK]
JP496  M01PTH_SMD_3.25X0.85MM_NO_SILK  [1X01_SMD_3.25X0.85MM_NO_SILK]
JP497  M01PTH_SMD_3.25X0.85MM_NO_SILK  [1X01_SMD_3.25X0.85MM_NO_SILK]
JP498  M01PTH_SMD_3.25X0.85MM_NO_SILK  [1X01_SMD_3.25X0.85MM_NO_SILK]
JP499  M01PTH_SMD_3.25X0.85MM_NO_SILK  [1X01_SMD_3.25X0.85MM_NO_SILK]
JP500  M01PTH_SMD_3.25X0.85MM_NO_SILK  [1X01_SMD_3.25X0.85MM_NO_SILK]
JP501  M01PTH_SMD_3.25X0.85MM_NO_SILK  [1X01_SMD_3.25X0.85MM_NO_SILK]
JP502  M01PTH_SMD_3.25X0.85MM_NO_SILK  [1X01_SMD_3.25X0.85MM_NO_SILK]
JP503  M01PTH_SMD_3.25X0.85MM_NO_SILK  [1X01_SMD_3.25X0.85MM_NO_SILK]
JP504  M01PTH_SMD_3.25X0.85MM_NO_SILK  [1X01_SMD_3.25X0.85MM_NO_SILK]
JP505  M01PTH_SMD_3.25X0.85MM_NO_SILK  [1X01_SMD_3.25X0.85MM_NO_SILK]
JP506  M01PTH_SMD_3.25X0.85MM_NO_SILK  [1X01_SMD_3.25X0.85MM_NO_SILK]
JP507  M01PTH_SMD_3.25X0.85MM_NO_SILK  [1X01_SMD_3.25X0.85MM_NO_SILK]
JP508  M01PTH_SMD_3.25X0.85MM_NO_SILK  [1X01_SMD_3.25X0.85MM_NO_SILK]
JP509  M01PTH_SMD_3.25X0.85MM_NO_SILK  [1X01_SMD_3.25X0.85MM_NO_SILK]
JP510  M01PTH_SMD_3.25X0.85MM_NO_SILK  [1X01_SMD_3.25X0.85MM_NO_SILK]
JP511  M01PTH_SMD_3.25X0.85MM_NO_SILK  [1X01_SMD_3.25X0.85MM_NO_SILK]
JP512  M01PTH_SMD_3.25X0.85MM_NO_SILK  [1X01_SMD_3.25X0.85MM_NO_SILK]
JP513  M01PTH_SMD_3.25X0.85MM_NO_SILK  [1X01_SMD_3.25X0.85MM_NO_SILK]
JP514  M01PTH_SMD_3.25X0.85MM_NO_SILK  [1X01_SMD_3.25X0.85MM_NO_SILK]
JP515  M01PTH_SMD_3.25X0.85MM_NO_SILK  [1X01_SMD_3.25X0.85MM_NO_SILK]
JP516  M01PTH_SMD_3.25X0.85MM_NO_SILK  [1X01_SMD_3.25X0.85MM_NO_SILK]
JP517  M01PTH_SMD_3.25X0.85MM_NO_SILK  [1X01_SMD_3.25X0.85MM_NO_SILK]
JP518  M01PTH_SMD_3.25X0.85MM_NO_SILK  [1X01_SMD_3.25X0.85MM_NO_SILK]
JP519  M01PTH_SMD_3.25X0.85MM_NO_SILK  [1X01_SMD_3.25X0.85MM_NO_SILK]
JP520  M01PTH_SMD_3.25X0.85MM_NO_SILK  [1X01_SMD_3.25X0.85MM_NO_SILK]
JP521  M01PTH_SMD_3.25X0.85MM_NO_SILK  [1X01_SMD_3.25X0.85MM_NO_SILK]
JP522  M01PTH_SMD_3.25X0.85MM_NO_SILK  [1X01_SMD_3.25X0.85MM_NO_SILK]
JP523  M01PTH_SMD_3.25X0.85MM_NO_SILK  [1X01_SMD_3.25X0.85MM_NO_SILK]
JP524  M01PTH_SMD_3.25X0.85MM_NO_SILK  [1X01_SMD_3.25X0.85MM_NO_SILK]
JP525  M01PTH_SMD_3.25X0.85MM_NO_SILK  [1X01_SMD_3.25X0.85MM_NO_SILK]
JP526  M01PTH_SMD_3.25X0.85MM_NO_SILK  [1X01_SMD_3.25X0.85MM_NO_SILK]
JP527  M01PTH_SMD_3.25X0.85MM_NO_SILK  [1X01_SMD_3.25X0.85MM_NO_SILK]
JP528  M01PTH_SMD_3.25X0.85MM_NO_SILK  [1X01_SMD_3.25X0.85MM_NO_SILK]
JP529  M01PTH_SMD_3.25X0.85MM_NO_SILK  [1X01_SMD_3.25X0.85MM_NO_SILK]
JP530  M01PTH_SMD_3.25X0.85MM_NO_SILK  [1X01_SMD_3.25X0.85MM_NO_SILK]
JP531  M01PTH_SMD_3.25X0.85MM_NO_SILK  [1X01_SMD_3.25X0.85MM_NO_SILK]
JP532  M01PTH_SMD_3.25X0.85MM_NO_SILK  [1X01_SMD_3.25X0.85MM_NO_SILK]
JP533  M01PTH_SMD_3.25X0.85MM_NO_SILK  [1X01_SMD_3.25X0.85MM_NO_SILK]
JP534  M01PTH_SMD_3.25X0.85MM_NO_SILK  [1X01_SMD_3.25X0.85MM_NO_SILK]
JP535  M01PTH_SMD_3.25X0.85MM_NO_SILK  [1X01_SMD_3.25X0.85MM_NO_SILK]
JP536  M01PTH_SMD_3.25X0.85MM_NO_SILK  [1X01_SMD_3.25X0.85MM_NO_SILK]
JP537  M01PTH_SMD_3.25X0.85MM_NO_SILK  [1X01_SMD_3.25X0.85MM_NO_SILK]
JP538  M01PTH_SMD_3.25X0.85MM_NO_SILK  [1X01_SMD_3.25X0.85MM_NO_SILK]
JP539  M01PTH_SMD_3.25X0.85MM_NO_SILK  [1X01_SMD_3.25X0.85MM_NO_SILK]
JP540  M01PTH_SMD_3.25X0.85MM_NO_SILK  [1X01_SMD_3.25X0.85MM_NO_SILK]
JP541  M01PTH_SMD_3.25X0.85MM_NO_SILK  [1X01_SMD_3.25X0.85MM_NO_SILK]
JP542  M01PTH_SMD_3.25X0.85MM_NO_SILK  [1X01_SMD_3.25X0.85MM_NO_SILK]
JP543  M01PTH_SMD_3.25X0.85MM_NO_SILK  [1X01_SMD_3.25X0.85MM_NO_SILK]
JP544  M01PTH_SMD_3.25X0.85MM_NO_SILK  [1X01_SMD_3.25X0.85MM_NO_SILK]
JP545  M01PTH_SMD_3.25X0.85MM_NO_SILK  [1X01_SMD_3.25X0.85MM_NO_SILK]
JP546  M01PTH_SMD_3.25X0.85MM_NO_SILK  [1X01_SMD_3.25X0.85MM_NO_SILK]
JP547  M01PTH_SMD_3.25X0.85MM_NO_SILK  [1X01_SMD_3.25X0.85MM_NO_SILK]
JP548  M01PTH_SMD_3.25X0.85MM_NO_SILK  [1X01_SMD_3.25X0.85MM_NO_SILK]
JP549  M01PTH_SMD_3.25X0.85MM_NO_SILK  [1X01_SMD_3.25X0.85MM_NO_SILK]
JP550  M01PTH_SMD_3.25X0.85MM_NO_SILK  [1X01_SMD_3.25X0.85MM_NO_SILK]
JP551  M01PTH_SMD_3.25X0.85MM_NO_SILK  [1X01_SMD_3.25X0.85MM_NO_SILK]
JP552  M01PTH_SMD_3.25X0.85MM_NO_SILK  [1X01_SMD_3.25X0.85MM_NO_SILK]
JP553  M01PTH_SMD_3.25X0.85MM_NO_SILK  [1X01_SMD_3.25X0.85MM_NO_SILK]
JP554  M01PTH_SMD_3.25X0.85MM_NO_SILK  [1X01_SMD_3.25X0.85MM_NO_SILK]
JP555  M01PTH_SMD_3.25X0.85MM_NO_SILK  [1X01_SMD_3.25X0.85MM_NO_SILK]
JP556  M01PTH_SMD_3.25X0.85MM_NO_SILK  [1X01_SMD_3.25X0.85MM_NO_SILK]
JP557  M01PTH_SMD_3.25X0.85MM_NO_SILK  [1X01_SMD_3.25X0.85MM_NO_SILK]
JP558  M01PTH_SMD_3.25X0.85MM_NO_SILK  [1X01_SMD_3.25X0.85MM_NO_SILK]
JP559  M01PTH_SMD_3.25X0.85MM_NO_SILK  [1X01_SMD_3.25X0.85MM_NO_SILK]
JP560  M01PTH_SMD_3.25X0.85MM_NO_SILK  [1X01_SMD_3.25X0.85MM_NO_SILK]
JP561  M01PTH_SMD_3.25X0.85MM_NO_SILK  [1X01_SMD_3.25X0.85MM_NO_SILK]
JP562  M01PTH_SMD_3.25X0.85MM_NO_SILK  [1X01_SMD_3.25X0.85MM_NO_SILK]
JP563  M01PTH_SMD_3.25X0.85MM_NO_SILK  [1X01_SMD_3.25X0.85MM_NO_SILK]
JP564  M01PTH_SMD_3.25X0.85MM_NO_SILK  [1X01_SMD_3.25X0.85MM_NO_SILK]
JP565  M01PTH_SMD_3.25X0.85MM_NO_SILK  [1X01_SMD_3.25X0.85MM_NO_SILK]
JP566  M01PTH_SMD_3.25X0.85MM_NO_SILK  [1X01_SMD_3.25X0.85MM_NO_SILK]
JP567  M01PTH_SMD_3.25X0.85MM_NO_SILK  [1X01_SMD_3.25X0.85MM_NO_SILK]
JP568  M01PTH_SMD_3.25X0.85MM_NO_SILK  [1X01_SMD_3.25X0.85MM_NO_SILK]
JP569  M01PTH_SMD_3.25X0.85MM_NO_SILK  [1X01_SMD_3.25X0.85MM_NO_SILK]
JP570  M01PTH_SMD_3.25X0.85MM_NO_SILK  [1X01_SMD_3.25X0.85MM_NO_SILK]
JP571  M01PTH_SMD_3.25X0.85MM_NO_SILK  [1X01_SMD_3.25X0.85MM_NO_SILK]
JP572  M01PTH_SMD_3.25X0.85MM_NO_SILK  [1X01_SMD_3.25X0.85MM_NO_SILK]
JP573  M01PTH_SMD_3.25X0.85MM_NO_SILK  [1X01_SMD_3.25X0.85MM_NO_SILK]
JP574  M01PTH_SMD_3.25X0.85MM_NO_SILK  [1X01_SMD_3.25X0.85MM_NO_SILK]
JP575  M01PTH_SMD_3.25X0.85MM_NO_SILK  [1X01_SMD_3.25X0.85MM_NO_SILK]
JP576  M01PTH_SMD_3.25X0.85MM_NO_SILK  [1X01_SMD_3.25X0.85MM_NO_SILK]
JP577  M01PTH_SMD_3.25X0.85MM_NO_SILK  [1X01_SMD_3.25X0.85MM_NO_SILK]
JP578  M01PTH_SMD_3.25X0.85MM_NO_SILK  [1X01_SMD_3.25X0.85MM_NO_SILK]
JP579  M01PTH_SMD_3.25X0.85MM_NO_SILK  [1X01_SMD_3.25X0.85MM_NO_SILK]
JP580  M01PTH_SMD_3.25X0.85MM_NO_SILK  [1X01_SMD_3.25X0.85MM_NO_SILK]
JP581  M01PTH_SMD_3.25X0.85MM_NO_SILK  [1X01_SMD_3.25X0.85MM_NO_SILK]
JP582  M01PTH_SMD_3.25X0.85MM_NO_SILK  [1X01_SMD_3.25X0.85MM_NO_SILK]
JP583  M01PTH_SMD_3.25X0.85MM_NO_SILK  [1X01_SMD_3.25X0.85MM_NO_SILK]
JP584  M01PTH_SMD_3.25X0.85MM_NO_SILK  [1X01_SMD_3.25X0.85MM_NO_SILK]
JP585  M01PTH_SMD_3.25X0.85MM_NO_SILK  [1X01_SMD_3.25X0.85MM_NO_SILK]
JP586  M01PTH_SMD_3.25X0.85MM_NO_SILK  [1X01_SMD_3.25X0.85MM_NO_SILK]
JP587  M01PTH_SMD_3.25X0.85MM_NO_SILK  [1X01_SMD_3.25X0.85MM_NO_SILK]
JP588  M01PTH_SMD_3.25X0.85MM_NO_SILK  [1X01_SMD_3.25X0.85MM_NO_SILK]
JP589  M01PTH_SMD_3.25X0.85MM_NO_SILK  [1X01_SMD_3.25X0.85MM_NO_SILK]
JP590  M01PTH_SMD_3.25X0.85MM_NO_SILK  [1X01_SMD_3.25X0.85MM_NO_SILK]
JP591  M01PTH_SMD_3.25X0.85MM_NO_SILK  [1X01_SMD_3.25X0.85MM_NO_SILK]
JP592  M01PTH_SMD_3.25X0.85MM_NO_SILK  [1X01_SMD_3.25X0.85MM_NO_SILK]
JP593  M01PTH_SMD_3.25X0.85MM_NO_SILK  [1X01_SMD_3.25X0.85MM_NO_SILK]
JP594  M01PTH_SMD_3.25X0.85MM_NO_SILK  [1X01_SMD_3.25X0.85MM_NO_SILK]
JP595  M01PTH_SMD_3.25X0.85MM_NO_SILK  [1X01_SMD_3.25X0.85MM_NO_SILK]
JP596  M01PTH_SMD_3.25X0.85MM_NO_SILK  [1X01_SMD_3.25X0.85MM_NO_SILK]
JP597  M01PTH_SMD_3.25X0.85MM_NO_SILK  [1X01_SMD_3.25X0.85MM_NO_SILK]
JP598  M01PTH_SMD_3.25X0.85MM_NO_SILK  [1X01_SMD_3.25X0.85MM_NO_SILK]
JP599  M01PTH_SMD_3.25X0.85MM_NO_SILK  [1X01_SMD_3.25X0.85MM_NO_SILK]
JP600  M01PTH_SMD_3.25X0.85MM_NO_SILK  [1X01_SMD_3.25X0.85MM_NO_SILK]
JP601  M01PTH_SMD_3.25X0.85MM_NO_SILK  [1X01_SMD_3.25X0.85MM_NO_SILK]
JP602  M01PTH_SMD_3.25X0.85MM_NO_SILK  [1X01_SMD_3.25X0.85MM_NO_SILK]
JP603  M01PTH_SMD_3.25X0.85MM_NO_SILK  [1X01_SMD_3.25X0.85MM_NO_SILK]
JP604  M01PTH_SMD_3.25X0.85MM_NO_SILK  [1X01_SMD_3.25X0.85MM_NO_SILK]
JP605  M01PTH_SMD_3.25X0.85MM_NO_SILK  [1X01_SMD_3.25X0.85MM_NO_SILK]
JP606  M01PTH_SMD_3.25X0.85MM_NO_SILK  [1X01_SMD_3.25X0.85MM_NO_SILK]
JP607  M01PTH_SMD_3.25X0.85MM_NO_SILK  [1X01_SMD_3.25X0.85MM_NO_SILK]
JP608  M01PTH_SMD_3.25X0.85MM_NO_SILK  [1X01_SMD_3.25X0.85MM_NO_SILK]
JP609  M01PTH_SMD_3.25X0.85MM_NO_SILK  [1X01_SMD_3.25X0.85MM_NO_SILK]
JP610  M01PTH_SMD_3.25X0.85MM_NO_SILK  [1X01_SMD_3.25X0.85MM_NO_SILK]
JP611  M01PTH_SMD_3.25X0.85MM_NO_SILK  [1X01_SMD_3.25X0.85MM_NO_SILK]
JP612  M01PTH_SMD_3.25X0.85MM_NO_SILK  [1X01_SMD_3.25X0.85MM_NO_SILK]
JP613  M01PTH_SMD_3.25X0.85MM_NO_SILK  [1X01_SMD_3.25X0.85MM_NO_SILK]
JP614  M01PTH_SMD_3.25X0.85MM_NO_SILK  [1X01_SMD_3.25X0.85MM_NO_SILK]
JP615  M01PTH_SMD_3.25X0.85MM_NO_SILK  [1X01_SMD_3.25X0.85MM_NO_SILK]
JP616  M01PTH_SMD_3.25X0.85MM_NO_SILK  [1X01_SMD_3.25X0.85MM_NO_SILK]
JP617  M01PTH_SMD_3.25X0.85MM_NO_SILK  [1X01_SMD_3.25X0.85MM_NO_SILK]
JP618  M01PTH_SMD_3.25X0.85MM_NO_SILK  [1X01_SMD_3.25X0.85MM_NO_SILK]
JP619  M01PTH_SMD_3.25X0.85MM_NO_SILK  [1X01_SMD_3.25X0.85MM_NO_SILK]
JP620  M01PTH_SMD_3.25X0.85MM_NO_SILK  [1X01_SMD_3.25X0.85MM_NO_SILK]
JP621  M01PTH_SMD_3.25X0.85MM_NO_SILK  [1X01_SMD_3.25X0.85MM_NO_SILK]
JP622  M01PTH_SMD_3.25X0.85MM_NO_SILK  [1X01_SMD_3.25X0.85MM_NO_SILK]
JP623  M01PTH_SMD_3.25X0.85MM_NO_SILK  [1X01_SMD_3.25X0.85MM_NO_SILK]
JP624  M01PTH_SMD_3.25X0.85MM_NO_SILK  [1X01_SMD_3.25X0.85MM_NO_SILK]
JP625  M01PTH_SMD_3.25X0.85MM_NO_SILK  [1X01_SMD_3.25X0.85MM_NO_SILK]
JP626  M01PTH_SMD_3.25X0.85MM_NO_SILK  [1X01_SMD_3.25X0.85MM_NO_SILK]
JP627  M01PTH_SMD_3.25X0.85MM_NO_SILK  [1X01_SMD_3.25X0.85MM_NO_SILK]
JP628  M01PTH_SMD_3.25X0.85MM_NO_SILK  [1X01_SMD_3.25X0.85MM_NO_SILK]
JP629  M01PTH_SMD_3.25X0.85MM_NO_SILK  [1X01_SMD_3.25X0.85MM_NO_SILK]
JP630  M01PTH_SMD_3.25X0.85MM_NO_SILK  [1X01_SMD_3.25X0.85MM_NO_SILK]
JP631  M01PTH_SMD_3.25X0.85MM_NO_SILK  [1X01_SMD_3.25X0.85MM_NO_SILK]
JP632  M01PTH_SMD_3.25X0.85MM_NO_SILK  [1X01_SMD_3.25X0.85MM_NO_SILK]
JP633  M01PTH_SMD_3.25X0.85MM_NO_SILK  [1X01_SMD_3.25X0.85MM_NO_SILK]
JP634  M01PTH_SMD_3.25X0.85MM_NO_SILK  [1X01_SMD_3.25X0.85MM_NO_SILK]
JP635  M01PTH_SMD_3.25X0.85MM_NO_SILK  [1X01_SMD_3.25X0.85MM_NO_SILK]
JP636  M01PTH_SMD_3.25X0.85MM_NO_SILK  [1X01_SMD_3.25X0.85MM_NO_SILK]
JP637  M01PTH_SMD_3.25X0.85MM_NO_SILK  [1X01_SMD_3.25X0.85MM_NO_SILK]
JP638  M01PTH_SMD_3.25X0.85MM_NO_SILK  [1X01_SMD_3.25X0.85MM_NO_SILK]
JP639  M01PTH_SMD_3.25X0.85MM_NO_SILK  [1X01_SMD_3.25X0.85MM_NO_SILK]
JP640  M01PTH_SMD_3.25X0.85MM_NO_SILK  [1X01_SMD_3.25X0.85MM_NO_SILK]
JP641  M01PTH_SMD_3.25X0.85MM_NO_SILK  [1X01_SMD_3.25X0.85MM_NO_SILK]
JP642  M01PTH_SMD_3.25X0.85MM_NO_SILK  [1X01_SMD_3.25X0.85MM_NO_SILK]
JP643  M01PTH_SMD_3.25X0.85MM_NO_SILK  [1X01_SMD_3.25X0.85MM_NO_SILK]
JP644  M01PTH_SMD_3.25X0.85MM_NO_SILK  [1X01_SMD_3.25X0.85MM_NO_SILK]
JP645  M01PTH_SMD_3.25X0.85MM_NO_SILK  [1X01_SMD_3.25X0.85MM_NO_SILK]
JP646  M01PTH_SMD_3.25X0.85MM_NO_SILK  [1X01_SMD_3.25X0.85MM_NO_SILK]
JP647  M01PTH_SMD_3.25X0.85MM_NO_SILK  [1X01_SMD_3.25X0.85MM_NO_SILK]
JP648  M01PTH_SMD_3.25X0.85MM_NO_SILK  [1X01_SMD_3.25X0.85MM_NO_SILK]
JP649  M01PTH_SMD_3.25X0.85MM_NO_SILK  [1X01_SMD_3.25X0.85MM_NO_SILK]
JP650  M01PTH_SMD_3.25X0.85MM_NO_SILK  [1X01_SMD_3.25X0.85MM_NO_SILK]
JP651  M01PTH_SMD_3.25X0.85MM_NO_SILK  [1X01_SMD_3.25X0.85MM_NO_SILK]
JP652  M01PTH_SMD_3.25X0.85MM_NO_SILK  [1X01_SMD_3.25X0.85MM_NO_SILK]
JP653  M01PTH_SMD_3.25X0.85MM_NO_SILK  [1X01_SMD_3.25X0.85MM_NO_SILK]
JP654  M01PTH_SMD_3.25X0.85MM_NO_SILK  [1X01_SMD_3.25X0.85MM_NO_SILK]
JP655  M01PTH_SMD_3.25X0.85MM_NO_SILK  [1X01_SMD_3.25X0.85MM_NO_SILK]
JP656  M01PTH_SMD_3.25X0.85MM_NO_SILK  [1X01_SMD_3.25X0.85MM_NO_SILK]
JP657  M01PTH_SMD_3.25X0.85MM_NO_SILK  [1X01_SMD_3.25X0.85MM_NO_SILK]
JP658  M01PTH_SMD_3.25X0.85MM_NO_SILK  [1X01_SMD_3.25X0.85MM_NO_SILK]
JP659  M01PTH_SMD_3.25X0.85MM_NO_SILK  [1X01_SMD_3.25X0.85MM_NO_SILK]
JP660  M01PTH_SMD_3.25X0.85MM_NO_SILK  [1X01_SMD_3.25X0.85MM_NO_SILK]
JP661  M01PTH_SMD_3.25X0.85MM_NO_SILK  [1X01_SMD_3.25X0.85MM_NO_SILK]
JP662  M01PTH_SMD_3.25X0.85MM_NO_SILK  [1X01_SMD_3.25X0.85MM_NO_SILK]
JP663  M01PTH_SMD_3.25X0.85MM_NO_SILK  [1X01_SMD_3.25X0.85MM_NO_SILK]
JP664  M01PTH_SMD_3.25X0.85MM_NO_SILK  [1X01_SMD_3.25X0.85MM_NO_SILK]
JP665  M01PTH_SMD_3.25X0.85MM_NO_SILK  [1X01_SMD_3.25X0.85MM_NO_SILK]
JP666  M01PTH_SMD_3.25X0.85MM_NO_SILK  [1X01_SMD_3.25X0.85MM_NO_SILK]
JP667  M01PTH_SMD_3.25X0.85MM_NO_SILK  [1X01_SMD_3.25X0.85MM_NO_SILK]
JP668  M01PTH_SMD_3.25X0.85MM_NO_SILK  [1X01_SMD_3.25X0.85MM_NO_SILK]
JP669  M01PTH_SMD_3.25X0.85MM_NO_SILK  [1X01_SMD_3.25X0.85MM_NO_SILK]
JP670  M01PTH_SMD_3.25X0.85MM_NO_SILK  [1X01_SMD_3.25X0.85MM_NO_SILK]
JP671  M01PTH_SMD_3.25X0.85MM_NO_SILK  [1X01_SMD_3.25X0.85MM_NO_SILK]
JP672  M01PTH_SMD_3.25X0.85MM_NO_SILK  [1X01_SMD_3.25X0.85MM_NO_SILK]
JP673  M01PTH_SMD_3.25X0.85MM_NO_SILK  [1X01_SMD_3.25X0.85MM_NO_SILK]
JP674  M01PTH_SMD_3.25X0.85MM_NO_SILK  [1X01_SMD_3.25X0.85MM_NO_SILK]
JP675  M01PTH_SMD_3.25X0.85MM_NO_SILK  [1X01_SMD_3.25X0.85MM_NO_SILK]
JP676  M01PTH_SMD_3.25X0.85MM_NO_SILK  [1X01_SMD_3.25X0.85MM_NO_SILK]
JP677  M01PTH_SMD_3.25X0.85MM_NO_SILK  [1X01_SMD_3.25X0.85MM_NO_SILK]
JP678  M01PTH_SMD_3.25X0.85MM_NO_SILK  [1X01_SMD_3.25X0.85MM_NO_SILK]
JP679  M01PTH_SMD_3.25X0.85MM_NO_SILK  [1X01_SMD_3.25X0.85MM_NO_SILK]
JP680  M01PTH_SMD_3.25X0.85MM_NO_SILK  [1X01_SMD_3.25X0.85MM_NO_SILK]
JP681  M01PTH_SMD_3.25X0.85MM_NO_SILK  [1X01_SMD_3.25X0.85MM_NO_SILK]
JP682  M01PTH_SMD_3.25X0.85MM_NO_SILK  [1X01_SMD_3.25X0.85MM_NO_SILK]
JP683  M01PTH_SMD_3.25X0.85MM_NO_SILK  [1X01_SMD_3.25X0.85MM_NO_SILK]
JP684  M01PTH_SMD_3.25X0.85MM_NO_SILK  [1X01_SMD_3.25X0.85MM_NO_SILK]
JP685  M01PTH_SMD_3.25X0.85MM_NO_SILK  [1X01_SMD_3.25X0.85MM_NO_SILK]
JP686  M01PTH_SMD_3.25X0.85MM_NO_SILK  [1X01_SMD_3.25X0.85MM_NO_SILK]
JP687  M01PTH_SMD_3.25X0.85MM_NO_SILK  [1X01_SMD_3.25X0.85MM_NO_SILK]
JP688  M01PTH_SMD_3.25X0.85MM_NO_SILK  [1X01_SMD_3.25X0.85MM_NO_SILK]
JP689  M01PTH_SMD_3.25X0.85MM_NO_SILK  [1X01_SMD_3.25X0.85MM_NO_SILK]
JP690  M01PTH_SMD_3.25X0.85MM_NO_SILK  [1X01_SMD_3.25X0.85MM_NO_SILK]
JP691  M01PTH_SMD_3.25X0.85MM_NO_SILK  [1X01_SMD_3.25X0.85MM_NO_SILK]
JP692  M01PTH_SMD_3.25X0.85MM_NO_SILK  [1X01_SMD_3.25X0.85MM_NO_SILK]
JP693  M01PTH_SMD_3.25X0.85MM_NO_SILK  [1X01_SMD_3.25X0.85MM_NO_SILK]
JP694  M01PTH_SMD_3.25X0.85MM_NO_SILK  [1X01_SMD_3.25X0.85MM_NO_SILK]
JP695  M01PTH_SMD_3.25X0.85MM_NO_SILK  [1X01_SMD_3.25X0.85MM_NO_SILK]
JP696  M01PTH_SMD_3.25X0.85MM_NO_SILK  [1X01_SMD_3.25X0.85MM_NO_SILK]
JP697  M01PTH_SMD_3.25X0.85MM_NO_SILK  [1X01_SMD_3.25X0.85MM_NO_SILK]
JP698  M01PTH_SMD_3.25X0.85MM_NO_SILK  [1X01_SMD_3.25X0.85MM_NO_SILK]
JP699  M01PTH_SMD_3.25X0.85MM_NO_SILK  [1X01_SMD_3.25X0.85MM_NO_SILK]
JP700  M01PTH_SMD_3.25X0.85MM_NO_SILK  [1X01_SMD_3.25X0.85MM_NO_SILK]
JP701  M01PTH_SMD_3.25X0.85MM_NO_SILK  [1X01_SMD_3.25X0.85MM_NO_SILK]
JP702  M01PTH_SMD_3.25X0.85MM_NO_SILK  [1X01_SMD_3.25X0.85MM_NO_SILK]
JP703  M01PTH_SMD_3.25X0.85MM_NO_SILK  [1X01_SMD_3.25X0.85MM_NO_SILK]
JP704  M01PTH_SMD_3.25X0.85MM_NO_SILK  [1X01_SMD_3.25X0.85MM_NO_SILK]
JP705  M01PTH_SMD_3.25X0.85MM_NO_SILK  [1X01_SMD_3.25X0.85MM_NO_SILK]
JP706  M01PTH_SMD_3.25X0.85MM_NO_SILK  [1X01_SMD_3.25X0.85MM_NO_SILK]
JP707  M01PTH_SMD_3.25X0.85MM_NO_SILK  [1X01_SMD_3.25X0.85MM_NO_SILK]
JP708  M01PTH_SMD_3.25X0.85MM_NO_SILK  [1X01_SMD_3.25X0.85MM_NO_SILK]
JP709  M01PTH_SMD_3.25X0.85MM_NO_SILK  [1X01_SMD_3.25X0.85MM_NO_SILK]
JP710  M01PTH_SMD_3.25X0.85MM_NO_SILK  [1X01_SMD_3.25X0.85MM_NO_SILK]
JP711  M01PTH_SMD_3.25X0.85MM_NO_SILK  [1X01_SMD_3.25X0.85MM_NO_SILK]
JP712  M01PTH_SMD_3.25X0.85MM_NO_SILK  [1X01_SMD_3.25X0.85MM_NO_SILK]
JP713  M01PTH_SMD_3.25X0.85MM_NO_SILK  [1X01_SMD_3.25X0.85MM_NO_SILK]
JP714  M01PTH_SMD_3.25X0.85MM_NO_SILK  [1X01_SMD_3.25X0.85MM_NO_SILK]
JP715  M01PTH_SMD_3.25X0.85MM_NO_SILK  [1X01_SMD_3.25X0.85MM_NO_SILK]
JP716  M01PTH_SMD_3.25X0.85MM_NO_SILK  [1X01_SMD_3.25X0.85MM_NO_SILK]
JP717  M01PTH_SMD_3.25X0.85MM_NO_SILK  [1X01_SMD_3.25X0.85MM_NO_SILK]
JP718  M01PTH_SMD_3.25X0.85MM_NO_SILK  [1X01_SMD_3.25X0.85MM_NO_SILK]
JP719  M01PTH_SMD_3.25X0.85MM_NO_SILK  [1X01_SMD_3.25X0.85MM_NO_SILK]
JP720  M01PTH_SMD_3.25X0.85MM_NO_SILK  [1X01_SMD_3.25X0.85MM_NO_SILK]
JP721  M01PTH_SMD_3.25X0.85MM_NO_SILK  [1X01_SMD_3.25X0.85MM_NO_SILK]
JP722  M01PTH_SMD_3.25X0.85MM_NO_SILK  [1X01_SMD_3.25X0.85MM_NO_SILK]
JP723  M01PTH_SMD_3.25X0.85MM_NO_SILK  [1X01_SMD_3.25X0.85MM_NO_SILK]
JP724  M01PTH_SMD_3.25X0.85MM_NO_SILK  [1X01_SMD_3.25X0.85MM_NO_SILK]
JP725  M01PTH_SMD_3.25X0.85MM_NO_SILK  [1X01_SMD_3.25X0.85MM_NO_SILK]
JP726  M01PTH_SMD_3.25X0.85MM_NO_SILK  [1X01_SMD_3.25X0.85MM_NO_SILK]
JP727  M01PTH_SMD_3.25X0.85MM_NO_SILK  [1X01_SMD_3.25X0.85MM_NO_SILK]
JP728  M01PTH_SMD_3.25X0.85MM_NO_SILK  [1X01_SMD_3.25X0.85MM_NO_SILK]
JP729  M01PTH_SMD_3.25X0.85MM_NO_SILK  [1X01_SMD_3.25X0.85MM_NO_SILK]
JP730  M01PTH_SMD_3.25X0.85MM_NO_SILK  [1X01_SMD_3.25X0.85MM_NO_SILK]
JP731  M01PTH_SMD_3.25X0.85MM_NO_SILK  [1X01_SMD_3.25X0.85MM_NO_SILK]
JP732  M01PTH_SMD_3.25X0.85MM_NO_SILK  [1X01_SMD_3.25X0.85MM_NO_SILK]
JP733  M01PTH_SMD_3.25X0.85MM_NO_SILK  [1X01_SMD_3.25X0.85MM_NO_SILK]
JP734  M01PTH_SMD_3.25X0.85MM_NO_SILK  [1X01_SMD_3.25X0.85MM_NO_SILK]
JP735  M01PTH_SMD_3.25X0.85MM_NO_SILK  [1X01_SMD_3.25X0.85MM_NO_SILK]
JP736  M01PTH_SMD_3.25X0.85MM_NO_SILK  [1X01_SMD_3.25X0.85MM_NO_SILK]
JP737  M01PTH_SMD_3.25X0.85MM_NO_SILK  [1X01_SMD_3.25X0.85MM_NO_SILK]
JP738  M01PTH_SMD_3.25X0.85MM_NO_SILK  [1X01_SMD_3.25X0.85MM_NO_SILK]
JP739  M01PTH_SMD_3.25X0.85MM_NO_SILK  [1X01_SMD_3.25X0.85MM_NO_SILK]
JP740  M01PTH_SMD_3.25X0.85MM_NO_SILK  [1X01_SMD_3.25X0.85MM_NO_SILK]
JP741  M01PTH_SMD_3.25X0.85MM_NO_SILK  [1X01_SMD_3.25X0.85MM_NO_SILK]
JP742  M01PTH_SMD_3.25X0.85MM_NO_SILK  [1X01_SMD_3.25X0.85MM_NO_SILK]
JP743  M01PTH_SMD_3.25X0.85MM_NO_SILK  [1X01_SMD_3.25X0.85MM_NO_SILK]
JP744  M01PTH_SMD_3.25X0.85MM_NO_SILK  [1X01_SMD_3.25X0.85MM_NO_SILK]
JP745  M01PTH_SMD_3.25X0.85MM_NO_SILK  [1X01_SMD_3.25X0.85MM_NO_SILK]
JP746  M01PTH_SMD_3.25X0.85MM_NO_SILK  [1X01_SMD_3.25X0.85MM_NO_SILK]
JP747  M01PTH_SMD_3.25X0.85MM_NO_SILK  [1X01_SMD_3.25X0.85MM_NO_SILK]
JP748  M01PTH_SMD_3.25X0.85MM_NO_SILK  [1X01_SMD_3.25X0.85MM_NO_SILK]
JP749  M01PTH_SMD_3.25X0.85MM_NO_SILK  [1X01_SMD_3.25X0.85MM_NO_SILK]
JP750  M01PTH_SMD_3.25X0.85MM_NO_SILK  [1X01_SMD_3.25X0.85MM_NO_SILK]
JP751  M01PTH_SMD_3.25X0.85MM_NO_SILK  [1X01_SMD_3.25X0.85MM_NO_SILK]
JP752  M01PTH_SMD_3.25X0.85MM_NO_SILK  [1X01_SMD_3.25X0.85MM_NO_SILK]
JP753  M01PTH_SMD_3.25X0.85MM_NO_SILK  [1X01_SMD_3.25X0.85MM_NO_SILK]
JP754  M01PTH_SMD_3.25X0.85MM_NO_SILK  [1X01_SMD_3.25X0.85MM_NO_SILK]
JP755  M01PTH_SMD_3.25X0.85MM_NO_SILK  [1X01_SMD_3.25X0.85MM_NO_SILK]
JP756  M01PTH_SMD_3.25X0.85MM_NO_SILK  [1X01_SMD_3.25X0.85MM_NO_SILK]
JP757  M01PTH_SMD_3.25X0.85MM_NO_SILK  [1X01_SMD_3.25X0.85MM_NO_SILK]
JP758  M01PTH_SMD_3.25X0.85MM_NO_SILK  [1X01_SMD_3.25X0.85MM_NO_SILK]
JP759  M01PTH_SMD_3.25X0.85MM_NO_SILK  [1X01_SMD_3.25X0.85MM_NO_SILK]
JP760  M01PTH_SMD_3.25X0.85MM_NO_SILK  [1X01_SMD_3.25X0.85MM_NO_SILK]
JP761  M01PTH_SMD_3.25X0.85MM_NO_SILK  [1X01_SMD_3.25X0.85MM_NO_SILK]
JP762  M01PTH_SMD_3.25X0.85MM_NO_SILK  [1X01_SMD_3.25X0.85MM_NO_SILK]
JP763  M01PTH_SMD_3.25X0.85MM_NO_SILK  [1X01_SMD_3.25X0.85MM_NO_SILK]
JP764  M01PTH_SMD_3.25X0.85MM_NO_SILK  [1X01_SMD_3.25X0.85MM_NO_SILK]
JP765  M01PTH_SMD_3.25X0.85MM_NO_SILK  [1X01_SMD_3.25X0.85MM_NO_SILK]
JP766  M01PTH_SMD_3.25X0.85MM_NO_SILK  [1X01_SMD_3.25X0.85MM_NO_SILK]
JP767  M01PTH_SMD_3.25X0.85MM_NO_SILK  [1X01_SMD_3.25X0.85MM_NO_SILK]
JP768  M01PTH_SMD_3.25X0.85MM_NO_SILK  [1X01_SMD_3.25X0.85MM_NO_SILK]
JP769  M01PTH_SMD_3.25X0.85MM_NO_SILK  [1X01_SMD_3.25X0.85MM_NO_SILK]
JP770  M01PTH_SMD_3.25X0.85MM_NO_SILK  [1X01_SMD_3.25X0.85MM_NO_SILK]
JP771  M01PTH_SMD_3.25X0.85MM_NO_SILK  [1X01_SMD_3.25X0.85MM_NO_SILK]
JP772  M01PTH_SMD_3.25X0.85MM_NO_SILK  [1X01_SMD_3.25X0.85MM_NO_SILK]
JP773  M01PTH_SMD_3.25X0.85MM_NO_SILK  [1X01_SMD_3.25X0.85MM_NO_SILK]
JP774  M01PTH_SMD_3.25X0.85MM_NO_SILK  [1X01_SMD_3.25X0.85MM_NO_SILK]
JP775  M01PTH_SMD_3.25X0.85MM_NO_SILK  [1X01_SMD_3.25X0.85MM_NO_SILK]
JP776  M01PTH_SMD_3.25X0.85MM_NO_SILK  [1X01_SMD_3.25X0.85MM_NO_SILK]
JP777  M01PTH_SMD_3.25X0.85MM_NO_SILK  [1X01_SMD_3.25X0.85MM_NO_SILK]
JP778  M01PTH_SMD_3.25X0.85MM_NO_SILK  [1X01_SMD_3.25X0.85MM_NO_SILK]
JP779  M01PTH_SMD_3.25X0.85MM_NO_SILK  [1X01_SMD_3.25X0.85MM_NO_SILK]
JP780  M01PTH_SMD_3.25X0.85MM_NO_SILK  [1X01_SMD_3.25X0.85MM_NO_SILK]
JP781  M01PTH_SMD_3.25X0.85MM_NO_SILK  [1X01_SMD_3.25X0.85MM_NO_SILK]
JP782  M01PTH_SMD_3.25X0.85MM_NO_SILK  [1X01_SMD_3.25X0.85MM_NO_SILK]
JP783  M01PTH_SMD_3.25X0.85MM_NO_SILK  [1X01_SMD_3.25X0.85MM_NO_SILK]
JP784  M01PTH_SMD_3.25X0.85MM_NO_SILK  [1X01_SMD_3.25X0.85MM_NO_SILK]
JP785  M01PTH_SMD_3.25X0.85MM_NO_SILK  [1X01_SMD_3.25X0.85MM_NO_SILK]
JP786  M01PTH_SMD_3.25X0.85MM_NO_SILK  [1X01_SMD_3.25X0.85MM_NO_SILK]
JP787  M01PTH_SMD_3.25X0.85MM_NO_SILK  [1X01_SMD_3.25X0.85MM_NO_SILK]
JP788  M01PTH_SMD_3.25X0.85MM_NO_SILK  [1X01_SMD_3.25X0.85MM_NO_SILK]
JP789  M01PTH_SMD_3.25X0.85MM_NO_SILK  [1X01_SMD_3.25X0.85MM_NO_SILK]
JP790  M01PTH_SMD_3.25X0.85MM_NO_SILK  [1X01_SMD_3.25X0.85MM_NO_SILK]
JP791  M01PTH_SMD_3.25X0.85MM_NO_SILK  [1X01_SMD_3.25X0.85MM_NO_SILK]
JP792  M01PTH_SMD_3.25X0.85MM_NO_SILK  [1X01_SMD_3.25X0.85MM_NO_SILK]
JP793  M01PTH_SMD_3.25X0.85MM_NO_SILK  [1X01_SMD_3.25X0.85MM_NO_SILK]
JP794  M01PTH_SMD_3.25X0.85MM_NO_SILK  [1X01_SMD_3.25X0.85MM_NO_SILK]
JP795  M01PTH_SMD_3.25X0.85MM_NO_SILK  [1X01_SMD_3.25X0.85MM_NO_SILK]
JP796  M01PTH_SMD_3.25X0.85MM_NO_SILK  [1X01_SMD_3.25X0.85MM_NO_SILK]
JP797  M01PTH_SMD_3.25X0.85MM_NO_SILK  [1X01_SMD_3.25X0.85MM_NO_SILK]
JP798  M01PTH_SMD_3.25X0.85MM_NO_SILK  [1X01_SMD_3.25X0.85MM_NO_SILK]
JP799  M01PTH_SMD_3.25X0.85MM_NO_SILK  [1X01_SMD_3.25X0.85MM_NO_SILK]
JP800  M01PTH_SMD_3.25X0.85MM_NO_SILK  [1X01_SMD_3.25X0.85MM_NO_SILK]
JP801  M01PTH_SMD_3.25X0.85MM_NO_SILK  [1X01_SMD_3.25X0.85MM_NO_SILK]
JP802  M01PTH_SMD_3.25X0.85MM_NO_SILK  [1X01_SMD_3.25X0.85MM_NO_SILK]
JP803  M01PTH_SMD_3.25X0.85MM_NO_SILK  [1X01_SMD_3.25X0.85MM_NO_SILK]
JP804  M01PTH_SMD_3.25X0.85MM_NO_SILK  [1X01_SMD_3.25X0.85MM_NO_SILK]
JP805  M01PTH_SMD_3.25X0.85MM_NO_SILK  [1X01_SMD_3.25X0.85MM_NO_SILK]
JP806  M01PTH_SMD_3.25X0.85MM_NO_SILK  [1X01_SMD_3.25X0.85MM_NO_SILK]
JP807  M01PTH_SMD_3.25X0.85MM_NO_SILK  [1X01_SMD_3.25X0.85MM_NO_SILK]
JP808  M01PTH_SMD_3.25X0.85MM_NO_SILK  [1X01_SMD_3.25X0.85MM_NO_SILK]
JP809  M01PTH_SMD_3.25X0.85MM_NO_SILK  [1X01_SMD_3.25X0.85MM_NO_SILK]
JP810  M01PTH_SMD_3.25X0.85MM_NO_SILK  [1X01_SMD_3.25X0.85MM_NO_SILK]
JP811  M01PTH_SMD_3.25X0.85MM_NO_SILK  [1X01_SMD_3.25X0.85MM_NO_SILK]
JP812  M01PTH_SMD_3.25X0.85MM_NO_SILK  [1X01_SMD_3.25X0.85MM_NO_SILK]
JP813  M01PTH_SMD_3.25X0.85MM_NO_SILK  [1X01_SMD_3.25X0.85MM_NO_SILK]
JP814  M01PTH_SMD_3.25X0.85MM_NO_SILK  [1X01_SMD_3.25X0.85MM_NO_SILK]
JP815  M01PTH_SMD_3.25X0.85MM_NO_SILK  [1X01_SMD_3.25X0.85MM_NO_SILK]
JP816  M01PTH_SMD_3.25X0.85MM_NO_SILK  [1X01_SMD_3.25X0.85MM_NO_SILK]
JP817  M01PTH_SMD_3.25X0.85MM_NO_SILK  [1X01_SMD_3.25X0.85MM_NO_SILK]
JP818  M01PTH_SMD_3.25X0.85MM_NO_SILK  [1X01_SMD_3.25X0.85MM_NO_SILK]
JP819  M01PTH_SMD_3.25X0.85MM_NO_SILK  [1X01_SMD_3.25X0.85MM_NO_SILK]
JP820  M01PTH_SMD_3.25X0.85MM_NO_SILK  [1X01_SMD_3.25X0.85MM_NO_SILK]
JP821  M01PTH_SMD_3.25X0.85MM_NO_SILK  [1X01_SMD_3.25X0.85MM_NO_SILK]
JP822  M01PTH_SMD_3.25X0.85MM_NO_SILK  [1X01_SMD_3.25X0.85MM_NO_SILK]
JP823  M01PTH_SMD_3.25X0.85MM_NO_SILK  [1X01_SMD_3.25X0.85MM_NO_SILK]
JP824  M01PTH_SMD_3.25X0.85MM_NO_SILK  [1X01_SMD_3.25X0.85MM_NO_SILK]
JP825  M01PTH_SMD_3.25X0.85MM_NO_SILK  [1X01_SMD_3.25X0.85MM_NO_SILK]
JP826  M01PTH_SMD_3.25X0.85MM_NO_SILK  [1X01_SMD_3.25X0.85MM_NO_SILK]
JP827  M01PTH_SMD_3.25X0.85MM_NO_SILK  [1X01_SMD_3.25X0.85MM_NO_SILK]
JP828  M01PTH_SMD_3.25X0.85MM_NO_SILK  [1X01_SMD_3.25X0.85MM_NO_SILK]
JP829  M01PTH_SMD_3.25X0.85MM_NO_SILK  [1X01_SMD_3.25X0.85MM_NO_SILK]
JP830  M01PTH_SMD_3.25X0.85MM_NO_SILK  [1X01_SMD_3.25X0.85MM_NO_SILK]
JP831  M01PTH_SMD_3.25X0.85MM_NO_SILK  [1X01_SMD_3.25X0.85MM_NO_SILK]
JP832  M01PTH_SMD_3.25X0.85MM_NO_SILK  [1X01_SMD_3.25X0.85MM_NO_SILK]
JP833  M01PTH_SMD_3.25X0.85MM_NO_SILK  [1X01_SMD_3.25X0.85MM_NO_SILK]
JP834  M01PTH_SMD_3.25X0.85MM_NO_SILK  [1X01_SMD_3.25X0.85MM_NO_SILK]
JP835  M01PTH_SMD_3.25X0.85MM_NO_SILK  [1X01_SMD_3.25X0.85MM_NO_SILK]
JP836  M01PTH_SMD_3.25X0.85MM_NO_SILK  [1X01_SMD_3.25X0.85MM_NO_SILK]
JP837  M01PTH_SMD_3.25X0.85MM_NO_SILK  [1X01_SMD_3.25X0.85MM_NO_SILK]
JP838  M01PTH_SMD_3.25X0.85MM_NO_SILK  [1X01_SMD_3.25X0.85MM_NO_SILK]
JP839  M01PTH_SMD_3.25X0.85MM_NO_SILK  [1X01_SMD_3.25X0.85MM_NO_SILK]
JP840  M01PTH_SMD_3.25X0.85MM_NO_SILK  [1X01_SMD_3.25X0.85MM_NO_SILK]
JP841  M01PTH_SMD_3.25X0.85MM_NO_SILK  [1X01_SMD_3.25X0.85MM_NO_SILK]
JP842  M01PTH_SMD_3.25X0.85MM_NO_SILK  [1X01_SMD_3.25X0.85MM_NO_SILK]
JP843  M01PTH_SMD_3.25X0.85MM_NO_SILK  [1X01_SMD_3.25X0.85MM_NO_SILK]
JP844  M01PTH_SMD_3.25X0.85MM_NO_SILK  [1X01_SMD_3.25X0.85MM_NO_SILK]
JP845  M01PTH_SMD_3.25X0.85MM_NO_SILK  [1X01_SMD_3.25X0.85MM_NO_SILK]
JP846  M01PTH_SMD_3.25X0.85MM_NO_SILK  [1X01_SMD_3.25X0.85MM_NO_SILK]
JP847  M01PTH_SMD_3.25X0.85MM_NO_SILK  [1X01_SMD_3.25X0.85MM_NO_SILK]
JP848  M01PTH_SMD_3.25X0.85MM_NO_SILK  [1X01_SMD_3.25X0.85MM_NO_SILK]
JP849  M01PTH_SMD_3.25X0.85MM_NO_SILK  [1X01_SMD_3.25X0.85MM_NO_SILK]
JP850  M01PTH_SMD_3.25X0.85MM_NO_SILK  [1X01_SMD_3.25X0.85MM_NO_SILK]
JP851  M01PTH_SMD_3.25X0.85MM_NO_SILK  [1X01_SMD_3.25X0.85MM_NO_SILK]
JP852  M01PTH_SMD_3.25X0.85MM_NO_SILK  [1X01_SMD_3.25X0.85MM_NO_SILK]
JP853  M01PTH_SMD_3.25X0.85MM_NO_SILK  [1X01_SMD_3.25X0.85MM_NO_SILK]
JP854  M01PTH_SMD_3.25X0.85MM_NO_SILK  [1X01_SMD_3.25X0.85MM_NO_SILK]
JP855  M01PTH_SMD_3.25X0.85MM_NO_SILK  [1X01_SMD_3.25X0.85MM_NO_SILK]
JP856  M01PTH_SMD_3.25X0.85MM_NO_SILK  [1X01_SMD_3.25X0.85MM_NO_SILK]
JP857  M01PTH_SMD_3.25X0.85MM_NO_SILK  [1X01_SMD_3.25X0.85MM_NO_SILK]
JP858  M01PTH_SMD_3.25X0.85MM_NO_SILK  [1X01_SMD_3.25X0.85MM_NO_SILK]
JP859  M01PTH_SMD_3.25X0.85MM_NO_SILK  [1X01_SMD_3.25X0.85MM_NO_SILK]
JP860  M01PTH_SMD_3.25X0.85MM_NO_SILK  [1X01_SMD_3.25X0.85MM_NO_SILK]
JP861  M01PTH_SMD_3.25X0.85MM_NO_SILK  [1X01_SMD_3.25X0.85MM_NO_SILK]
JP862  M01PTH_SMD_3.25X0.85MM_NO_SILK  [1X01_SMD_3.25X0.85MM_NO_SILK]
JP863  M01PTH_SMD_3.25X0.85MM_NO_SILK  [1X01_SMD_3.25X0.85MM_NO_SILK]
JP864  M01PTH_SMD_3.25X0.85MM_NO_SILK  [1X01_SMD_3.25X0.85MM_NO_SILK]
JP865  M01PTH_SMD_3.25X0.85MM_NO_SILK  [1X01_SMD_3.25X0.85MM_NO_SILK]
JP866  M01PTH_SMD_3.25X0.85MM_NO_SILK  [1X01_SMD_3.25X0.85MM_NO_SILK]
JP867  M01PTH_SMD_3.25X0.85MM_NO_SILK  [1X01_SMD_3.25X0.85MM_NO_SILK]
JP868  M01PTH_SMD_3.25X0.85MM_NO_SILK  [1X01_SMD_3.25X0.85MM_NO_SILK]
JP869  M01PTH_SMD_3.25X0.85MM_NO_SILK  [1X01_SMD_3.25X0.85MM_NO_SILK]
JP870  M01PTH_SMD_3.25X0.85MM_NO_SILK  [1X01_SMD_3.25X0.85MM_NO_SILK]
JP871  M01PTH_SMD_3.25X0.85MM_NO_SILK  [1X01_SMD_3.25X0.85MM_NO_SILK]
JP872  M01PTH_SMD_3.25X0.85MM_NO_SILK  [1X01_SMD_3.25X0.85MM_NO_SILK]
JP873  M01PTH_SMD_3.25X0.85MM_NO_SILK  [1X01_SMD_3.25X0.85MM_NO_SILK]
JP874  M01PTH_SMD_3.25X0.85MM_NO_SILK  [1X01_SMD_3.25X0.85MM_NO_SILK]
JP875  M01PTH_SMD_3.25X0.85MM_NO_SILK  [1X01_SMD_3.25X0.85MM_NO_SILK]
JP876  M01PTH_SMD_3.25X0.85MM_NO_SILK  [1X01_SMD_3.25X0.85MM_NO_SILK]
JP877  M01PTH_SMD_3.25X0.85MM_NO_SILK  [1X01_SMD_3.25X0.85MM_NO_SILK]
JP878  M01PTH_SMD_3.25X0.85MM_NO_SILK  [1X01_SMD_3.25X0.85MM_NO_SILK]
JP879  M01PTH_SMD_3.25X0.85MM_NO_SILK  [1X01_SMD_3.25X0.85MM_NO_SILK]
JP880  M01PTH_SMD_3.25X0.85MM_NO_SILK  [1X01_SMD_3.25X0.85MM_NO_SILK]
JP881  M01PTH_SMD_3.25X0.85MM_NO_SILK  [1X01_SMD_3.25X0.85MM_NO_SILK]
JP882  M01PTH_SMD_3.25X0.85MM_NO_SILK  [1X01_SMD_3.25X0.85MM_NO_SILK]
JP883  M01PTH_SMD_3.25X0.85MM_NO_SILK  [1X01_SMD_3.25X0.85MM_NO_SILK]
JP884  M01PTH_SMD_3.25X0.85MM_NO_SILK  [1X01_SMD_3.25X0.85MM_NO_SILK]
JP885  M01PTH_SMD_3.25X0.85MM_NO_SILK  [1X01_SMD_3.25X0.85MM_NO_SILK]
JP886  M01PTH_SMD_3.25X0.85MM_NO_SILK  [1X01_SMD_3.25X0.85MM_NO_SILK]
JP887  M01PTH_SMD_3.25X0.85MM_NO_SILK  [1X01_SMD_3.25X0.85MM_NO_SILK]
JP888  M01PTH_SMD_3.25X0.85MM_NO_SILK  [1X01_SMD_3.25X0.85MM_NO_SILK]
JP889  M01PTH_SMD_3.25X0.85MM_NO_SILK  [1X01_SMD_3.25X0.85MM_NO_SILK]
JP890  M01PTH_SMD_3.25X0.85MM_NO_SILK  [1X01_SMD_3.25X0.85MM_NO_SILK]
JP891  M01PTH_SMD_3.25X0.85MM_NO_SILK  [1X01_SMD_3.25X0.85MM_NO_SILK]
JP892  M01PTH_SMD_3.25X0.85MM_NO_SILK  [1X01_SMD_3.25X0.85MM_NO_SILK]
JP893  M01PTH_SMD_3.25X0.85MM_NO_SILK  [1X01_SMD_3.25X0.85MM_NO_SILK]
JP894  M01PTH_SMD_3.25X0.85MM_NO_SILK  [1X01_SMD_3.25X0.85MM_NO_SILK]
JP895  M01PTH_SMD_3.25X0.85MM_NO_SILK  [1X01_SMD_3.25X0.85MM_NO_SILK]
JP896  M01PTH_SMD_3.25X0.85MM_NO_SILK  [1X01_SMD_3.25X0.85MM_NO_SILK]
JP897  M01PTH_SMD_3.25X0.85MM_NO_SILK  [1X01_SMD_3.25X0.85MM_NO_SILK]
JP898  M01PTH_SMD_3.25X0.85MM_NO_SILK  [1X01_SMD_3.25X0.85MM_NO_SILK]
JP899  M01PTH_SMD_3.25X0.85MM_NO_SILK  [1X01_SMD_3.25X0.85MM_NO_SILK]
JP900  M01PTH_SMD_3.25X0.85MM_NO_SILK  [1X01_SMD_3.25X0.85MM_NO_SILK]
JP901  M01PTH_SMD_3.25X0.85MM_NO_SILK  [1X01_SMD_3.25X0.85MM_NO_SILK]
JP902  M01PTH_SMD_3.25X0.85MM_NO_SILK  [1X01_SMD_3.25X0.85MM_NO_SILK]
JP903  M01PTH_SMD_3.25X0.85MM_NO_SILK  [1X01_SMD_3.25X0.85MM_NO_SILK]
JP904  M01PTH_SMD_3.25X0.85MM_NO_SILK  [1X01_SMD_3.25X0.85MM_NO_SILK]
JP905  M01PTH_SMD_3.25X0.85MM_NO_SILK  [1X01_SMD_3.25X0.85MM_NO_SILK]
JP906  M01PTH_SMD_3.25X0.85MM_NO_SILK  [1X01_SMD_3.25X0.85MM_NO_SILK]
JP907  M01PTH_SMD_3.25X0.85MM_NO_SILK  [1X01_SMD_3.25X0.85MM_NO_SILK]
JP908  M01PTH_SMD_3.25X0.85MM_NO_SILK  [1X01_SMD_3.25X0.85MM_NO_SILK]
JP909  M01PTH_SMD_3.25X0.85MM_NO_SILK  [1X01_SMD_3.25X0.85MM_NO_SILK]
JP910  M01PTH_SMD_3.25X0.85MM_NO_SILK  [1X01_SMD_3.25X0.85MM_NO_SILK]
JP911  M01PTH_SMD_3.25X0.85MM_NO_SILK  [1X01_SMD_3.25X0.85MM_NO_SILK]
JP912  M01PTH_SMD_3.25X0.85MM_NO_SILK  [1X01_SMD_3.25X0.85MM_NO_SILK]
JP913  M01PTH_SMD_3.25X0.85MM_NO_SILK  [1X01_SMD_3.25X0.85MM_NO_SILK]
JP914  M01PTH_SMD_3.25X0.85MM_NO_SILK  [1X01_SMD_3.25X0.85MM_NO_SILK]
JP915  M01PTH_SMD_3.25X0.85MM_NO_SILK  [1X01_SMD_3.25X0.85MM_NO_SILK]
JP916  M01PTH_SMD_3.25X0.85MM_NO_SILK  [1X01_SMD_3.25X0.85MM_NO_SILK]
JP917  M01PTH_SMD_3.25X0.85MM_NO_SILK  [1X01_SMD_3.25X0.85MM_NO_SILK]
JP918  M01PTH_SMD_3.25X0.85MM_NO_SILK  [1X01_SMD_3.25X0.85MM_NO_SILK]
JP919  M01PTH_SMD_3.25X0.85MM_NO_SILK  [1X01_SMD_3.25X0.85MM_NO_SILK]
JP920  M01PTH_SMD_3.25X0.85MM_NO_SILK  [1X01_SMD_3.25X0.85MM_NO_SILK]
JP921  M01PTH_SMD_3.25X0.85MM_NO_SILK  [1X01_SMD_3.25X0.85MM_NO_SILK]
JP922  M01PTH_SMD_3.25X0.85MM_NO_SILK  [1X01_SMD_3.25X0.85MM_NO_SILK]
JP923  M01PTH_SMD_3.25X0.85MM_NO_SILK  [1X01_SMD_3.25X0.85MM_NO_SILK]
JP924  M01PTH_SMD_3.25X0.85MM_NO_SILK  [1X01_SMD_3.25X0.85MM_NO_SILK]
JP925  M01PTH_SMD_3.25X0.85MM_NO_SILK  [1X01_SMD_3.25X0.85MM_NO_SILK]
JP926  M01PTH_SMD_3.25X0.85MM_NO_SILK  [1X01_SMD_3.25X0.85MM_NO_SILK]
JP927  M01PTH_SMD_3.25X0.85MM_NO_SILK  [1X01_SMD_3.25X0.85MM_NO_SILK]
JP928  M01PTH_SMD_3.25X0.85MM_NO_SILK  [1X01_SMD_3.25X0.85MM_NO_SILK]
JP929  M01PTH_SMD_3.25X0.85MM_NO_SILK  [1X01_SMD_3.25X0.85MM_NO_SILK]
JP930  M01PTH_SMD_3.25X0.85MM_NO_SILK  [1X01_SMD_3.25X0.85MM_NO_SILK]
JP931  M01PTH_SMD_3.25X0.85MM_NO_SILK  [1X01_SMD_3.25X0.85MM_NO_SILK]
JP932  M01PTH_SMD_3.25X0.85MM_NO_SILK  [1X01_SMD_3.25X0.85MM_NO_SILK]
JP933  M01PTH_SMD_3.25X0.85MM_NO_SILK  [1X01_SMD_3.25X0.85MM_NO_SILK]
JP934  M01PTH_SMD_3.25X0.85MM_NO_SILK  [1X01_SMD_3.25X0.85MM_NO_SILK]
JP935  M01PTH_SMD_3.25X0.85MM_NO_SILK  [1X01_SMD_3.25X0.85MM_NO_SILK]
JP936  M01PTH_SMD_3.25X0.85MM_NO_SILK  [1X01_SMD_3.25X0.85MM_NO_SILK]
JP937  M01PTH_SMD_3.25X0.85MM_NO_SILK  [1X01_SMD_3.25X0.85MM_NO_SILK]
JP938  M01PTH_SMD_3.25X0.85MM_NO_SILK  [1X01_SMD_3.25X0.85MM_NO_SILK]
JP939  M01PTH_SMD_3.25X0.85MM_NO_SILK  [1X01_SMD_3.25X0.85MM_NO_SILK]
JP940  M01PTH_SMD_3.25X0.85MM_NO_SILK  [1X01_SMD_3.25X0.85MM_NO_SILK]
JP941  M01PTH_SMD_3.25X0.85MM_NO_SILK  [1X01_SMD_3.25X0.85MM_NO_SILK]
JP942  M01PTH_SMD_3.25X0.85MM_NO_SILK  [1X01_SMD_3.25X0.85MM_NO_SILK]
JP943  M01PTH_SMD_3.25X0.85MM_NO_SILK  [1X01_SMD_3.25X0.85MM_NO_SILK]
JP944  M01PTH_SMD_3.25X0.85MM_NO_SILK  [1X01_SMD_3.25X0.85MM_NO_SILK]
JP945  M01PTH_SMD_3.25X0.85MM_NO_SILK  [1X01_SMD_3.25X0.85MM_NO_SILK]
JP946  M01PTH_SMD_3.25X0.85MM_NO_SILK  [1X01_SMD_3.25X0.85MM_NO_SILK]
JP947  M01PTH_SMD_3.25X0.85MM_NO_SILK  [1X01_SMD_3.25X0.85MM_NO_SILK]
JP948  M01PTH_SMD_3.25X0.85MM_NO_SILK  [1X01_SMD_3.25X0.85MM_NO_SILK]
JP949  M01PTH_SMD_3.25X0.85MM_NO_SILK  [1X01_SMD_3.25X0.85MM_NO_SILK]
JP950  M01PTH_SMD_3.25X0.85MM_NO_SILK  [1X01_SMD_3.25X0.85MM_NO_SILK]
JP951  M01PTH_SMD_3.25X0.85MM_NO_SILK  [1X01_SMD_3.25X0.85MM_NO_SILK]
JP952  M01PTH_SMD_3.25X0.85MM_NO_SILK  [1X01_SMD_3.25X0.85MM_NO_SILK]
JP953  M01PTH_SMD_3.25X0.85MM_NO_SILK  [1X01_SMD_3.25X0.85MM_NO_SILK]
JP954  M01PTH_SMD_3.25X0.85MM_NO_SILK  [1X01_SMD_3.25X0.85MM_NO_SILK]
JP955  M01PTH_SMD_3.25X0.85MM_NO_SILK  [1X01_SMD_3.25X0.85MM_NO_SILK]
JP956  M01PTH_SMD_3.25X0.85MM_NO_SILK  [1X01_SMD_3.25X0.85MM_NO_SILK]
JP957  M01PTH_SMD_3.25X0.85MM_NO_SILK  [1X01_SMD_3.25X0.85MM_NO_SILK]
JP958  M01PTH_SMD_3.25X0.85MM_NO_SILK  [1X01_SMD_3.25X0.85MM_NO_SILK]
JP959  M01PTH_SMD_3.25X0.85MM_NO_SILK  [1X01_SMD_3.25X0.85MM_NO_SILK]
JP960  M01PTH_SMD_3.25X0.85MM_NO_SILK  [1X01_SMD_3.25X0.85MM_NO_SILK]
JP961  M01PTH_SMD_3.25X0.85MM_NO_SILK  [1X01_SMD_3.25X0.85MM_NO_SILK]
JP962  M01PTH_SMD_3.25X0.85MM_NO_SILK  [1X01_SMD_3.25X0.85MM_NO_SILK]
JP963  M01PTH_SMD_3.25X0.85MM_NO_SILK  [1X01_SMD_3.25X0.85MM_NO_SILK]
JP964  M01PTH_SMD_3.25X0.85MM_NO_SILK  [1X01_SMD_3.25X0.85MM_NO_SILK]
JP965  M01PTH_SMD_3.25X0.85MM_NO_SILK  [1X01_SMD_3.25X0.85MM_NO_SILK]
JP966  M01PTH_SMD_3.25X0.85MM_NO_SILK  [1X01_SMD_3.25X0.85MM_NO_SILK]
JP967  M01PTH_SMD_3.25X0.85MM_NO_SILK  [1X01_SMD_3.25X0.85MM_NO_SILK]
JP968  M01PTH_SMD_3.25X0.85MM_NO_SILK  [1X01_SMD_3.25X0.85MM_NO_SILK]
JP969  M01PTH_SMD_3.25X0.85MM_NO_SILK  [1X01_SMD_3.25X0.85MM_NO_SILK]
JP970  M01PTH_SMD_3.25X0.85MM_NO_SILK  [1X01_SMD_3.25X0.85MM_NO_SILK]
JP971  M01PTH_SMD_3.25X0.85MM_NO_SILK  [1X01_SMD_3.25X0.85MM_NO_SILK]
JP972  M01PTH_SMD_3.25X0.85MM_NO_SILK  [1X01_SMD_3.25X0.85MM_NO_SILK]
JP973  M01PTH_SMD_3.25X0.85MM_NO_SILK  [1X01_SMD_3.25X0.85MM_NO_SILK]
JP974  M01PTH_SMD_3.25X0.85MM_NO_SILK  [1X01_SMD_3.25X0.85MM_NO_SILK]
JP975  M01PTH_SMD_3.25X0.85MM_NO_SILK  [1X01_SMD_3.25X0.85MM_NO_SILK]
JP976  M01PTH_SMD_3.25X0.85MM_NO_SILK  [1X01_SMD_3.25X0.85MM_NO_SILK]
JP977  M01PTH_SMD_3.25X0.85MM_NO_SILK  [1X01_SMD_3.25X0.85MM_NO_SILK]
JP978  M01PTH_SMD_3.25X0.85MM_NO_SILK  [1X01_SMD_3.25X0.85MM_NO_SILK]
JP979  M01PTH_SMD_3.25X0.85MM_NO_SILK  [1X01_SMD_3.25X0.85MM_NO_SILK]
JP980  M01PTH_SMD_3.25X0.85MM_NO_SILK  [1X01_SMD_3.25X0.85MM_NO_SILK]
JP981  M01PTH_SMD_3.25X0.85MM_NO_SILK  [1X01_SMD_3.25X0.85MM_NO_SILK]
JP982  M01PTH_SMD_3.25X0.85MM_NO_SILK  [1X01_SMD_3.25X0.85MM_NO_SILK]
JP983  M01PTH_SMD_3.25X0.85MM_NO_SILK  [1X01_SMD_3.25X0.85MM_NO_SILK]
JP984  M01PTH_SMD_3.25X0.85MM_NO_SILK  [1X01_SMD_3.25X0.85MM_NO_SILK]
JP985  M01PTH_SMD_3.25X0.85MM_NO_SILK  [1X01_SMD_3.25X0.85MM_NO_SILK]
JP986  M01PTH_SMD_3.25X0.85MM_NO_SILK  [1X01_SMD_3.25X0.85MM_NO_SILK]
JP987  M01PTH_SMD_3.25X0.85MM_NO_SILK  [1X01_SMD_3.25X0.85MM_NO_SILK]
JP988  M01PTH_SMD_3.25X0.85MM_NO_SILK  [1X01_SMD_3.25X0.85MM_NO_SILK]
JP989  M01PTH_SMD_3.25X0.85MM_NO_SILK  [1X01_SMD_3.25X0.85MM_NO_SILK]
JP990  M01PTH_SMD_3.25X0.85MM_NO_SILK  [1X01_SMD_3.25X0.85MM_NO_SILK]
JP991  M01PTH_SMD_3.25X0.85MM_NO_SILK  [1X01_SMD_3.25X0.85MM_NO_SILK]
JP992  M01PTH_SMD_3.25X0.85MM_NO_SILK  [1X01_SMD_3.25X0.85MM_NO_SILK]
JP993  M01PTH_SMD_3.25X0.85MM_NO_SILK  [1X01_SMD_3.25X0.85MM_NO_SILK]
JP994  M01PTH_SMD_3.25X0.85MM_NO_SILK  [1X01_SMD_3.25X0.85MM_NO_SILK]
JP995  M01PTH_SMD_3.25X0.85MM_NO_SILK  [1X01_SMD_3.25X0.85MM_NO_SILK]
JP996  M01PTH_SMD_3.25X0.85MM_NO_SILK  [1X01_SMD_3.25X0.85MM_NO_SILK]
JP997  M01PTH_SMD_3.25X0.85MM_NO_SILK  [1X01_SMD_3.25X0.85MM_NO_SILK]
JP998  M01PTH_SMD_3.25X0.85MM_NO_SILK  [1X01_SMD_3.25X0.85MM_NO_SILK]
JP999  M01PTH_SMD_3.25X0.85MM_NO_SILK  [1X01_SMD_3.25X0.85MM_NO_SILK]
JP1000  M01PTH_SMD_3.25X0.85MM_NO_SILK  [1X01_SMD_3.25X0.85MM_NO_SILK]
JP1001  M01PTH_SMD_3.25X0.85MM_NO_SILK  [1X01_SMD_3.25X0.85MM_NO_SILK]
JP1002  M01PTH_SMD_3.25X0.85MM_NO_SILK  [1X01_SMD_3.25X0.85MM_NO_SILK]
JP1003  M01PTH_SMD_3.25X0.85MM_NO_SILK  [1X01_SMD_3.25X0.85MM_NO_SILK]
JP1004  M01PTH_SMD_3.25X0.85MM_NO_SILK  [1X01_SMD_3.25X0.85MM_NO_SILK]
JP1005  M01PTH_SMD_3.25X0.85MM_NO_SILK  [1X01_SMD_3.25X0.85MM_NO_SILK]
JP1006  M01PTH_SMD_3.25X0.85MM_NO_SILK  [1X01_SMD_3.25X0.85MM_NO_SILK]